# Altium project Gravix Sensor V1 - Rev A.PrjPcb
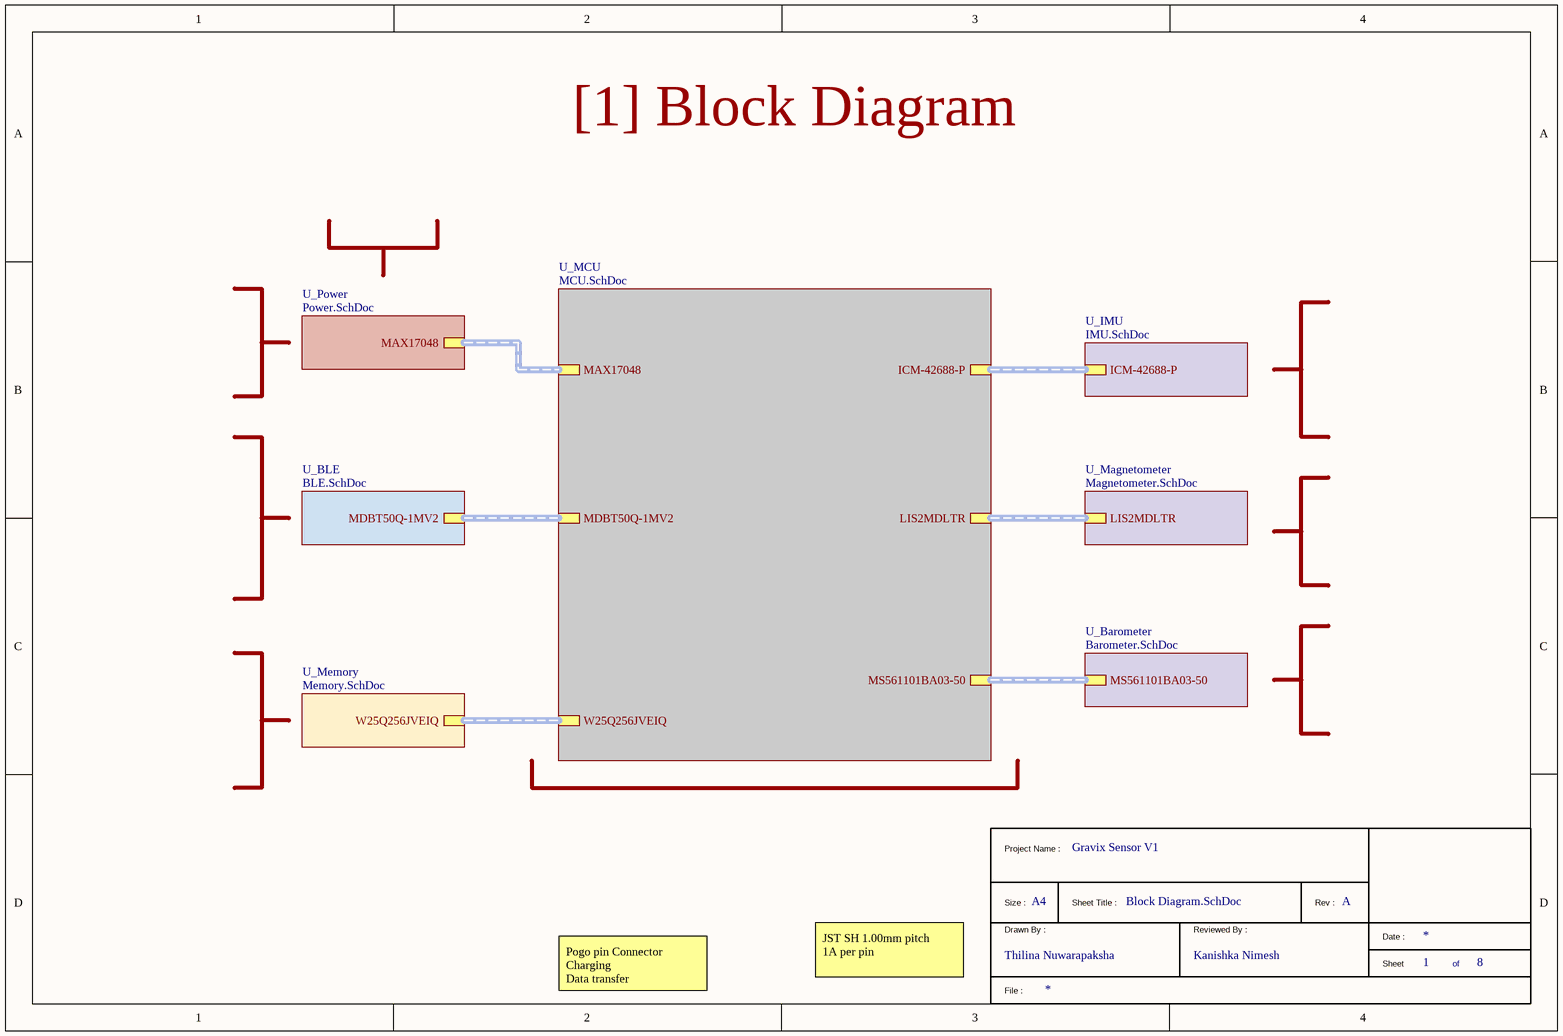
[diagram p0: Block Diagram.SchDoc]
CheckedBy: Kanishka Nimesh; DrawnBy: Thilina Nuwarapaksha; Revision: A; SheetSize: A4; Title: Gravix Sensor V1
8 sheets, 125 parts. Net scope: hierarchical (ports join the sheet entries above them; power ports are global).
Sheets:
  Block Diagram.SchDoc
    U_Power = Power.SchDoc
    U_Barometer = Barometer.SchDoc
    U_BLE = BLE.SchDoc
    U_IMU = IMU.SchDoc
    U_Magnetometer = Magnetometer.SchDoc
    U_MCU = MCU.SchDoc
    U_Memory = Memory.SchDoc

## Sheet Block Diagram.SchDoc: Gravix Sensor V1
size A4; SheetNumber: 1; SheetTotal: 8

### Parts
(Parts that share a designator on the sheet are numbered #1, #2 ... from top to bottom, then left to right.)
*#1  TitleBlock1  (value not drawn)  (graphical)

### Sub-sheets
U_Barometer = Barometer.SchDoc: MS561101BA03-50 (harness Barometer)
U_BLE = BLE.SchDoc: MDBT50Q-1MV2 (harness BLE)
U_IMU = IMU.SchDoc: ICM-42688-P (harness *)
U_Magnetometer = Magnetometer.SchDoc: LIS2MDLTR (harness Magnetometer)
U_MCU = MCU.SchDoc: ICM-42688-P (harness IMU), W25Q256JVEIQ (harness Memory), MAX17048 (harness Fuel gauge), LIS2MDLTR (harness Magnetometer), MS561101BA03-50 (harness Barometer), MDBT50Q-1MV2 (harness BLE)
U_Memory = Memory.SchDoc: W25Q256JVEIQ (harness Memory)
U_Power = Power.SchDoc: MAX17048 (harness Fuel gauge)

### Buses and harness runs
harness sheet U_Barometer/MS561101BA03-50 = sheet U_MCU/MS561101BA03-50
harness sheet U_BLE/MDBT50Q-1MV2 = sheet U_MCU/MDBT50Q-1MV2
harness sheet U_IMU/ICM-42688-P = sheet U_MCU/ICM-42688-P
harness sheet U_Magnetometer/LIS2MDLTR = sheet U_MCU/LIS2MDLTR
harness sheet U_MCU/MAX17048 = sheet U_Power/MAX17048
harness sheet U_MCU/W25Q256JVEIQ = sheet U_Memory/W25Q256JVEIQ

### Notes on the sheet
- [1] Block Diagram
- Pogo pin Connector
  Charging
  Data transfer
- (near *#1) JST SH 1.00mm pitch
  1A per pin
- (in symbol TitleBlock1) Project Name :; Size :; Sheet Title :; Rev :; Drawn By :; Reviewed By :; Date :; Sheet; of; File :

## Sheet Power.SchDoc: Gravix Sensor V1
size A3; SheetNumber: 2; SheetTotal: 8; SheetName: Power
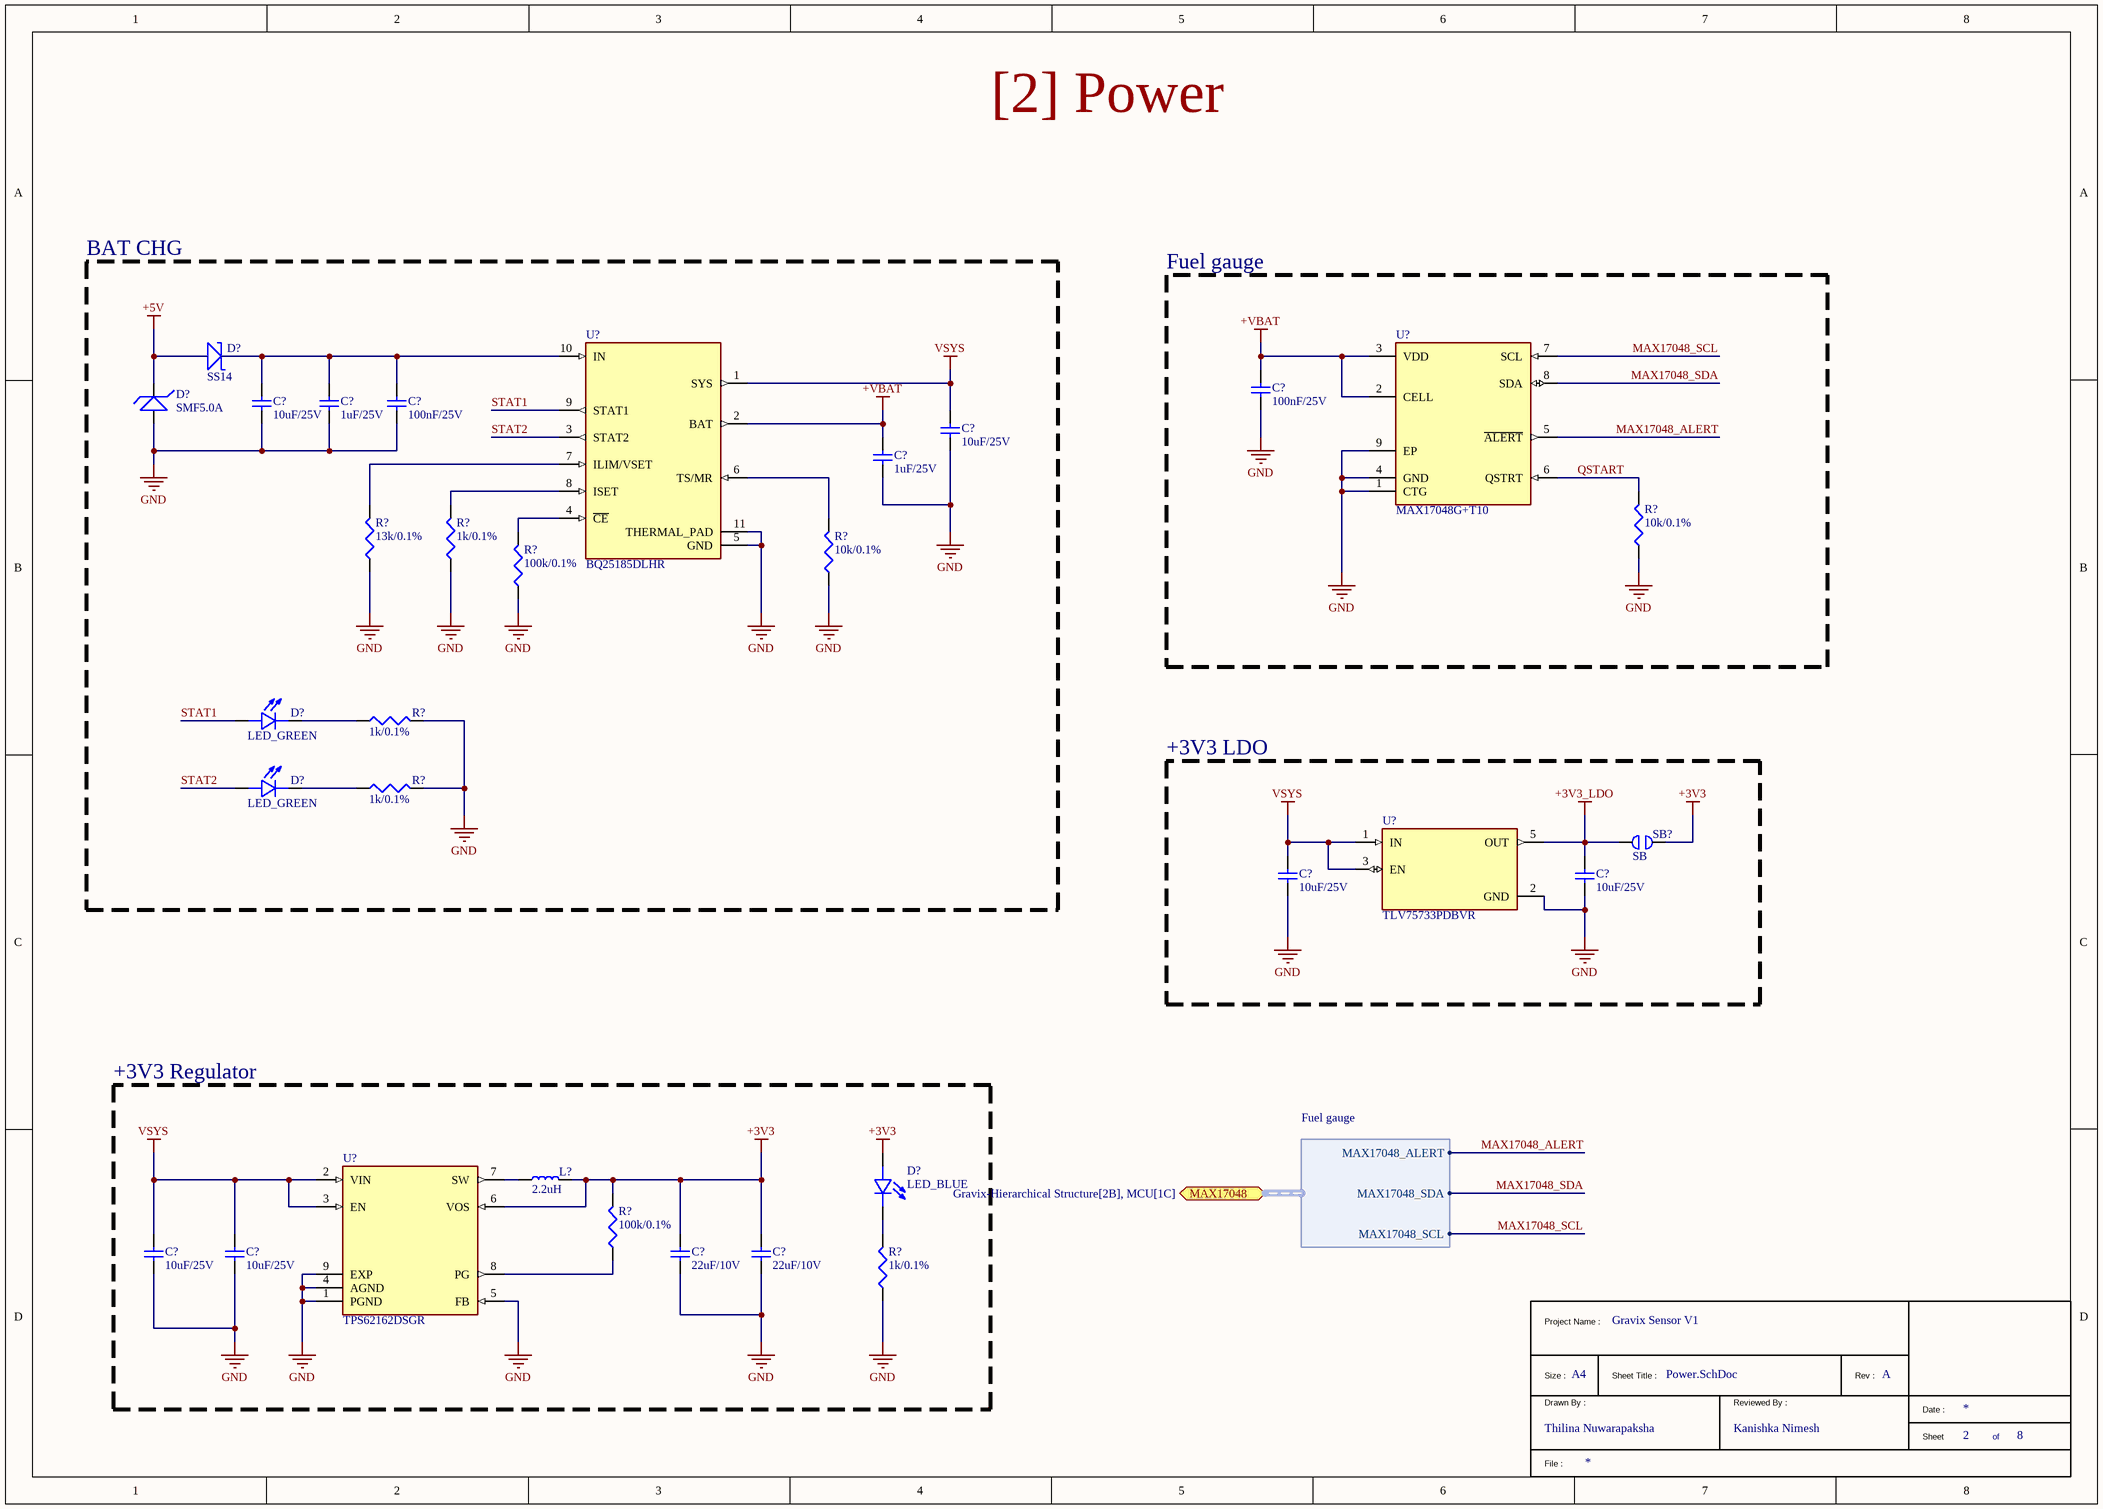
[diagram p1: Power.SchDoc]

### Parts
(Parts that share a designator on the sheet are numbered #1, #2 ... from top to bottom, then left to right.)
*#2  TitleBlock1  (value not drawn)  (graphical)
C?#1  100nF/25V  [CAP_0402]
C?#2  10uF/25V  [CAP_1206]
C?#3  1uF/25V  [CAP_0805]
C?#4  100nF/25V  [CAP_0402]
C?#5  10uF/25V  [CAP_1206]
C?#6  1uF/25V  [CAP_0805]
C?#7  10uF/25V  [CAP_1206]
C?#8  10uF/25V  [CAP_1206]
C?#9  10uF/25V  [CAP_1206]
C?#10  10uF/25V  [CAP_1206]
C?#11  22uF/10V  [CAP_1206]
C?#12  22uF/10V  [CAP_1206]
D?#1  SS14  [SS14_SMA(DO-214AC)]
D?#2  SMF5.0A  [SMF5.0A_]
D?#3  LED_GREEN  [LED_0402]
D?#4  LED_GREEN  [LED_0402]
D?#5  LED_BLUE  [LED_0402]
L?  2.2uH  [IND_SMD,3x3mm]
R?#1  10k/0.1%  [RES_0402]
R?#2  13k/0.1%  [RES_0402]
R?#3  1k/0.1%  [RES_0402]
R?#4  10k/0.1%  [RES_0402]
R?#5  100k/0.1%  [RES_0402]
R?#6  1k/0.1%  [RES_0402]
R?#7  1k/0.1%  [RES_0402]
R?#8  100k/0.1%  [RES_0402]
R?#9  1k/0.1%  [RES_0402]
SB?  SB  [SLD_2P]
U?#1  MAX17048G+T10  [MAX17048G+T10_TDFN-8]
U?#2  BQ25185DLHR  [BQ25185DLHR_WFDFN-10]
U?#3  TLV75733PDBVR  [TLV75733PDBVR_SOT-23-5]
U?#4  TPS62162DSGR  [TPS62162DSGR_WSON-8-EP(2x2)]

### Blocks framed on the sheet
BAT CHG: C?#2-C?#6 D?#1-D?#4 R?#2-R?#7 U?#2
Fuel gauge: C?#1 R?#1 U?#1
+3V3 LDO: C?#7 C?#8 SB? U?#3
+3V3 Regulator: C?#9-C?#12 D?#5 L? R?#8 R?#9 U?#4

### Ports
MAX17048 (bidir, harness Fuel gauge, see Gravix-Hierarchical Structure[2B], MCU[1C])

### Harnesses
Fuel gauge: MAX17048_SCL, MAX17048_SDA, MAX17048_ALERT

### Nets
+3V3: C?#11.2 C?#12.2 D?#5.A L?.2 R?#8.2 SB?.2 U?#4.6(VOS)
+3V3_LDO: C?#8.2 SB?.1 U?#3.5(OUT)
+5V: D?#1.2
+VBAT: C?#1.2 C?#6.2 U?#1.2(CELL) U?#1.3(VDD) U?#2.2(BAT)
GND: C?#1.1 C?#2.1 C?#3.1 C?#4.1 C?#5.1 C?#6.1 C?#7.1 C?#8.1 C?#9.1 C?#10.1 C?#11.1 C?#12.1 R?#1.1 R?#2.1 R?#3.1 R?#4.1 R?#5.1 R?#6.2 R?#7.2 R?#9.1 U?#1.1(CTG) U?#1.4(GND) U?#1.9(EP) U?#2.5(GND) U?#2.11(THERMAL_PAD) U?#3.2(GND) U?#4.1(PGND) U?#4.4(AGND) U?#4.5(FB) U?#4.9(EXP)
VSYS: C?#5.2 C?#7.2 C?#9.2 C?#10.2 U?#2.1(SYS) U?#3.1(IN) U?#3.3(EN) U?#4.2(VIN) U?#4.3(EN)
MAX17048_ALERT: U?#1.5(~{ALERT}) ; port MAX17048.MAX17048_ALERT
MAX17048_SCL: U?#1.7(SCL) ; port MAX17048.MAX17048_SCL
MAX17048_SDA: U?#1.8(SDA) ; port MAX17048.MAX17048_SDA  [project net MAX17048_SCL]
QSTART: R?#1.2 U?#1.6(QSTRT)
STAT1: D?#3.A U?#2.9(STAT1)
STAT2: D?#4.A U?#2.3(STAT2)
NetC?#2_2: C?#2.2 C?#3.2 C?#4.2 D?#1.1 U?#2.10(IN)
NetD?#3_C: D?#3.C R?#6.1
NetD?#4_C: D?#4.C R?#7.1
NetD?#5_C: D?#5.C R?#9.2
NetL?_1: L?.1 U?#4.7(SW)
NetR?#2_2: R?#2.2 U?#2.7(ILIM/VSET)
NetR?#3_2: R?#3.2 U?#2.8(ISET)
NetR?#4_2: R?#4.2 U?#2.6(TS/MR)
NetR?#5_2: R?#5.2 U?#2.4(~{CE})
NetR?#8_1: R?#8.1 U?#4.8(PG)

Not connected (* = marked no-connect by the designer): D?#2 1 2

### Notes on the sheet
- [2] Power
- (in symbol TitleBlock1) Project Name :; Size :; Sheet Title :; Rev :; Drawn By :; Reviewed By :; Date :; Sheet; of; File :

### Library data of the parts
C?#1 C?#4 = YAGEO CC0402JRX7R8BB104: 100nF ±5% 25V Ceramic Capacitor X7R 0402; Manufacturer: YAGEO; Manufacturer Part Number: CC0402JRX7R8BB104; LCSC Part Number: C541465; Package: 0402; Mounting Type: SMD; ComponentLink2Description: Digikey Link; ComponentLink3Description: LCSC Link; ComponentLink3URL: https://www.lcsc.com/product-detail/C541465.html?spm=wm.fly.bg.0.xh___wm.fly.dhl.mly.12-0-4&lcsc_vid=QlAIX1RQQQJfX1VRTwcNAQJXTlRaUQBVEQBYAwJfFFcxVlNRQFhYU1xWRFVdXztW
C?#2 C?#5 C?#7-C?#10 = muRata GRM31CR71E106KA12L: 10uF ±10% 25V Ceramic Capacitor X7R 1206; Manufacturer: muRata; Manufacturer Part Number: GRM31CR71E106KA12L; LCSC Part Number: C77093; Package: 1206; Mounting Type: SMD; ComponentLink2Description: Digikey Link; ComponentLink3Description: LCSC Link; ComponentLink3URL: https://www.lcsc.com/product-detail/C77093.html?spm=wm.fly.bg.1.xh___wm.sxq.dhl.mly.12-0-4&lcsc_vid=QlAIX1RQQQJfX1VRTwcNAQJXTlRaUQBVEQBYAwJfFFcxVlNRT1FaUl1VQVZcUDsOAxUeFF5JWBYZEEoKFBINSQcJGk4%3D
C?#3 C?#6 = YAGEO CC0805KKX7R8BB105: 1uF ±10% 25V Ceramic Capacitor X7R 0805; Manufacturer: YAGEO; Manufacturer Part Number: CC0805KKX7R8BB105; LCSC Part Number: C91186; Package: 0805; Mounting Type: SMD; ComponentLink2Description: Digikey Link; ComponentLink3Description: LCSC Link; ComponentLink3URL: https://www.lcsc.com/product-detail/C91186.html?spm=wm.fly.bg.0.xh___wm.fly.dhl.mly.12-0-4&lcsc_vid=QlAIX1RQQQJfX1VRTwcNAQJXTlRaUQBVEQBYAwJfFFcxVlNRT1FbV1FfR1JZUDsOAxUeFF5JWBYZEEoKFBINSQcJGk4dAgUUFAk%3D
C?#11 C?#12 = muRata GRM31CR71A226KE15L: 22uF ±10% 10V Ceramic Capacitor X7R 1206; Manufacturer: muRata; Manufacturer Part Number: GRM31CR71A226KE15L; LCSC Part Number: C91604; Package: 1206; Mounting Type: SMD; ComponentLink2Description: Digikey Link; ComponentLink3Description: LCSC Link; ComponentLink3URL: https://www.lcsc.com/product-detail/C91604.html?s_z=n_q_C91604
D?#1 = onsemi SS14: Diode 40V 1A Surface Mount SMA(DO-214AC); Manufacturer: onsemi; Manufacturer Part Number: SS14; LCSC Part Number: C83852; Package: SMA(DO-214AC); Mounting Type: SMD; ComponentLink2Description: Digikey Link; ComponentLink3Description: LCSC Link; ComponentLink3URL: https://www.lcsc.com/product-detail/C83852.html?s_z=n_q_x_SS14&spm=wm.ssy.em.2.tz&lcsc_vid=TgRYXlMEFQVcUQVUT1hcVlJUQ1MPAlRVQVBcVABeFAUxVlNRT1RZVFVUQVBXUTsOAxUeFF5JWBYZEEoKFBINSQcJGk4eFQsCAgIaSgADAwAHC0slRVVWV0oOAwwC
D?#2 = Littelfuse SMF5.0A: 9.2VC Clamp 21.7A Ipp TVS DIODE SOD-123FL; Manufacturer: Littelfuse; Manufacturer Part Number: SMF5.0A; LCSC Part Number: C151296; Package: SOD-123FL; Mounting Type: SMD; ComponentLink2Description: Digikey Link; ComponentLink3Description: LCSC Link; ComponentLink3URL: https://www.lcsc.com/product-detail/C151296.html?s_z=n_q_SMF5.0A&spm=wm.fly.bg.0.xh&lcsc_vid=TgRYXlMEFQVcUQVUT1hcVlJUQ1MPAlRVQVBcVABeFAUxVlNRT1RZVFRUQ1NdUTsOAxUeFF5JWBYZEEoKFBINSQcJGk4eFQsCAgIaSgADAwAHC0slQFRfXkoOAwwC
D?#3 D?#4 = LED_GREEN: Green 520nm LED Indication - Discrete 2.8V 0402; Manufacturer: BrtLed; Manufacturer Part Number: BL-HGK37A-AV-TRB; LCSC Part Number: C5123485; Package: 0402; ComponentLink1Description: Digikey Link; ComponentLink2Description: LCSC Link; ComponentLink2URL: https://www.lcsc.com/product-detail/C5123485.html?s_z=n_q_t_led&spm=wm.fly.bg.0.xh___wm.ssy.tc.0.tz&lcsc_vid=QlAIX1RQQQJfX1VRTwcNAQJXTlRaUQBVEQBYAwJfFFcxVlNRT1RWVlJfRFhYUjsOAxUeFF5JWBYZEEoKFBINSQcJGk4eFQsCAgIaSgADAwAHC0slRlZXU1VSWQkaCgg%3D; Mounting Type: SMD
D?#5 = LED_BLUE: Blue 468nm LED Indication - Discrete 2.8V 0402; Manufacturer: VISHAY; Manufacturer Part Number: VLMB1500-GS08; LCSC Part Number: C511042; Package: 0402; ComponentLink1Description: Digikey Link; ComponentLink2Description: LCSC Link; ComponentLink2URL: https://www.lcsc.com/product-detail/C511042.html?s_z=n_q_t_led&spm=wm.fly.bg.0.xh___wm.ssy.tc.0.tz&lcsc_vid=QlAIX1RQQQJfX1VRTwcNAQJXTlRaUQBVEQBYAwJfFFcxVlNRT1RWVlJfRFhYUjsOAxUeFF5JWBYZEEoKFBINSQcJGk4eFQsCAgIaSgADAwAHC0slRlZXU1VSWQkaCgg%3D; Mounting Type: SMD
L? = Coilcraft XFL3012-222MEC: 1.9A 2.2uH ±20% 97mΩ 1.6A Magnetic Shielded Inductor SMD,3x3mm Fixed Inductors RoHS; Manufacturer: Coilcraft; Manufacturer Part Number: XFL3012-222MEC; LCSC Part Number: C3911432; Package: SMD,3x3mm; ComponentLink1Description: Digikey Link; Mounting Type: SMD; ComponentLink2Description: LCSC Link; ComponentLink2URL: https://www.lcsc.com/product-detail/C3911432.html?s_z=n_q_XFL3012-222MEC&spm=wm.ssy.bg.0.xh&lcsc_vid=QlAIX1RQQQJfX1VRTwcNAQJXTlRaUQBVEQBYAwJfFFcxVlNRT1FaUl1VQVZcUDsOAxUeFF5JWBYZEEoKFBINSQcJGk4%3D
R?#1 R?#4 = YAGEO RT0402BRD0710KL: 62.5mW 10kΩ 50V Thin Film Resistor ±25ppm/℃ ±0.1% 0402 Chip Resistor - Surface Mount RoHS; Manufacturer: YAGEO; Manufacturer Part Number: RT0402BRD0710KL; LCSC Part Number: C190095; Package: 0402; ComponentLink1Description: Digikey Link; Mounting Type: SMD; ComponentLink2Description: LCSC Link; ComponentLink2URL: https://www.lcsc.com/product-detail/C190095.html?spm=wm.fly.bg.0.xh___wm.fly.dhl.mly.12-6-1&lcsc_vid=QlAIX1RQQQJfX1VRTwcNAQJXTlRaUQBVEQBYAwJfFFcxVlNRT1FbV1FfR1JZUDsOAxUeFF5JWBYZEEoKFBINSQcJGk4dAgUUFAk%3D
R?#2 = YAGEO RT0402BRD0713KL: 62.5mW 13kΩ 50V Thin Film Resistor ±25ppm/℃ ±0.1% 0402 Chip Resistor - Surface Mount RoHS; Manufacturer: YAGEO; Manufacturer Part Number: RT0402BRD0713KL; LCSC Part Number: C852524; Package: 0402; ComponentLink1Description: Digikey Link; Mounting Type: SMD; ComponentLink2Description: LCSC Link; ComponentLink2URL: https://www.lcsc.com/product-detail/C852524.html?spm=wm.fly.bg.0.xh___wm.sxq.dhl.mly.12-6-1&lcsc_vid=QlAIX1RQQQJfX1VRTwcNAQJXTlRaUQBVEQBYAwJfFFcxVlNRT1FbV1FfR1JZUDsOAxUeFF5JWBYZEEoKFBINSQcJGk4dAgUUFAk%3D
R?#3 R?#6 R?#7 R?#9 = YAGEO RT0402BRD071KL: 1kΩ 62.5mW 50V Thin Film Resistor ±25ppm/℃ ±0.1% 0402 Chip Resistor - Surface Mount RoHS; Manufacturer: YAGEO; Manufacturer Part Number: RT0402BRD071KL; LCSC Part Number: C852624; Package: 0402; ComponentLink1Description: Digikey Link; Mounting Type: SMD; ComponentLink2Description: LCSC Link; ComponentLink2URL: https://www.lcsc.com/product-detail/C852624.html?spm=wm.fly.bg.0.xh___wm.sxq.dhl.mly.12-6-1&lcsc_vid=QlAIX1RQQQJfX1VRTwcNAQJXTlRaUQBVEQBYAwJfFFcxVlNRT1FbV1FfR1JZUDsOAxUeFF5JWBYZEEoKFBINSQcJGk4dAgUUFAk%3D
R?#5 R?#8 = YAGEO RT0402BRD07100KL: 100kΩ 62.5mW 50V Thin Film Resistor ±25ppm/℃ ±0.1% 0402 Chip Resistor - Surface Mount RoHS; Manufacturer: YAGEO; Manufacturer Part Number: RT0402BRD07100KL; LCSC Part Number: C852472; Package: 0402; ComponentLink1Description: Digikey Link; Mounting Type: SMD; ComponentLink2Description: LCSC Link; ComponentLink2URL: https://www.lcsc.com/product-detail/C852472.html?spm=wm.fly.bg.0.xh___wm.fly.dhl.mly.12-6-1&lcsc_vid=QlAIX1RQQQJfX1VRTwcNAQJXTlRaUQBVEQBYAwJfFFcxVlNRT1FbV1FfR1JZUDsOAxUeFF5JWBYZEEoKFBINSQcJGk4dAgUUFAk%3D
SB? = SLD_2P
U?#1 = MAXIM MAX17048G+T10: Lithium Battery I2C DFN-8-EP(2x2) Battery Management RoHS; Manufacturer: MAXIM; Manufacturer Part Number: MAX17048G+T10; LCSC Part Number: C2682616; Package: DFN-8-EP(2x2); Mounting Type: SMD; ComponentLink2Description: Digikey Link; ComponentLink3Description: LCSC Link; ComponentLink3URL: https://www.lcsc.com/product-detail/C2682616.html?s_z=n_q_C2682616
U?#2 = TI BQ25185DLHR: 1-Cell, 1-A Standalone Linear Battery Charger with PowerPath, Factory Mode, and Battery Tracking VINDPM; Manufacturer: TI; Manufacturer Part Number: BQ25185DLHR; LCSC Part Number: C19725033; Package: WSON-10-EP(2.2x2); Mounting Type: SMD; ComponentLink2Description: Digikey Link; ComponentLink3Description: LCSC Link; ComponentLink3URL: https://www.lcsc.com/product-detail/C19725033.html?s_z=n_q_C19725033
U?#3 = TI TLV75733PDBVR: 3.3V Positive Fixed SOT-23-5 Voltage Regulators - Linear, Low Drop Out (LDO) Regulators RoHS; Manufacturer: TI; Manufacturer Part Number: TLV75733PDBVR; LCSC Part Number: C485517; Package: SOT-23-5; Mounting Type: SMD; ComponentLink2Description: Digikey Link; ComponentLink3Description: LCSC Link; ComponentLink3URL: https://www.lcsc.com/product-detail/C485517.html?spm=wm.fly.bg.0.xh&lcsc_vid=QlAIX1RQQQJfX1VRTwcNAQJXTlRaUQBVEQBYAwJfFFcxVlNRT1FbV1FfR1JZUDsOAxUeFF5JWBYZEEoKFBINSQcJGk4dAgUUFAk%3D
U?#4 = TI TPS62162DSGR: 2.25MHz Step-down type Fixed 3.3V 1A WSON-8-EP(2x2) Voltage Regulators - DC DC Switching Regulators RoHS; Manufacturer: TI; Manufacturer Part Number: TPS62162DSGR; LCSC Part Number: C40256; Package: WSON-8-EP(2x2); Mounting Type: SMD; ComponentLink2Description: Digikey Link; ComponentLink3Description: LCSC Link; ComponentLink3URL: https://www.lcsc.com/product-detail/C40256.html?s_z=n_q_TPS62162&spm=wm.ssy.bg.0.xh&lcsc_vid=QlAIX1RQQQJfX1VRTwcNAQJXTlRaUQBVEQBYAwJfFFcxVlNRQFhXUFJST1hcUTsOAxUeFF5JWBYZEEoKFBINSQcJGk4%3D

## Sheet Barometer.SchDoc: Gravix Sensor V1
size A4; SheetNumber: 6; SheetTotal: 8
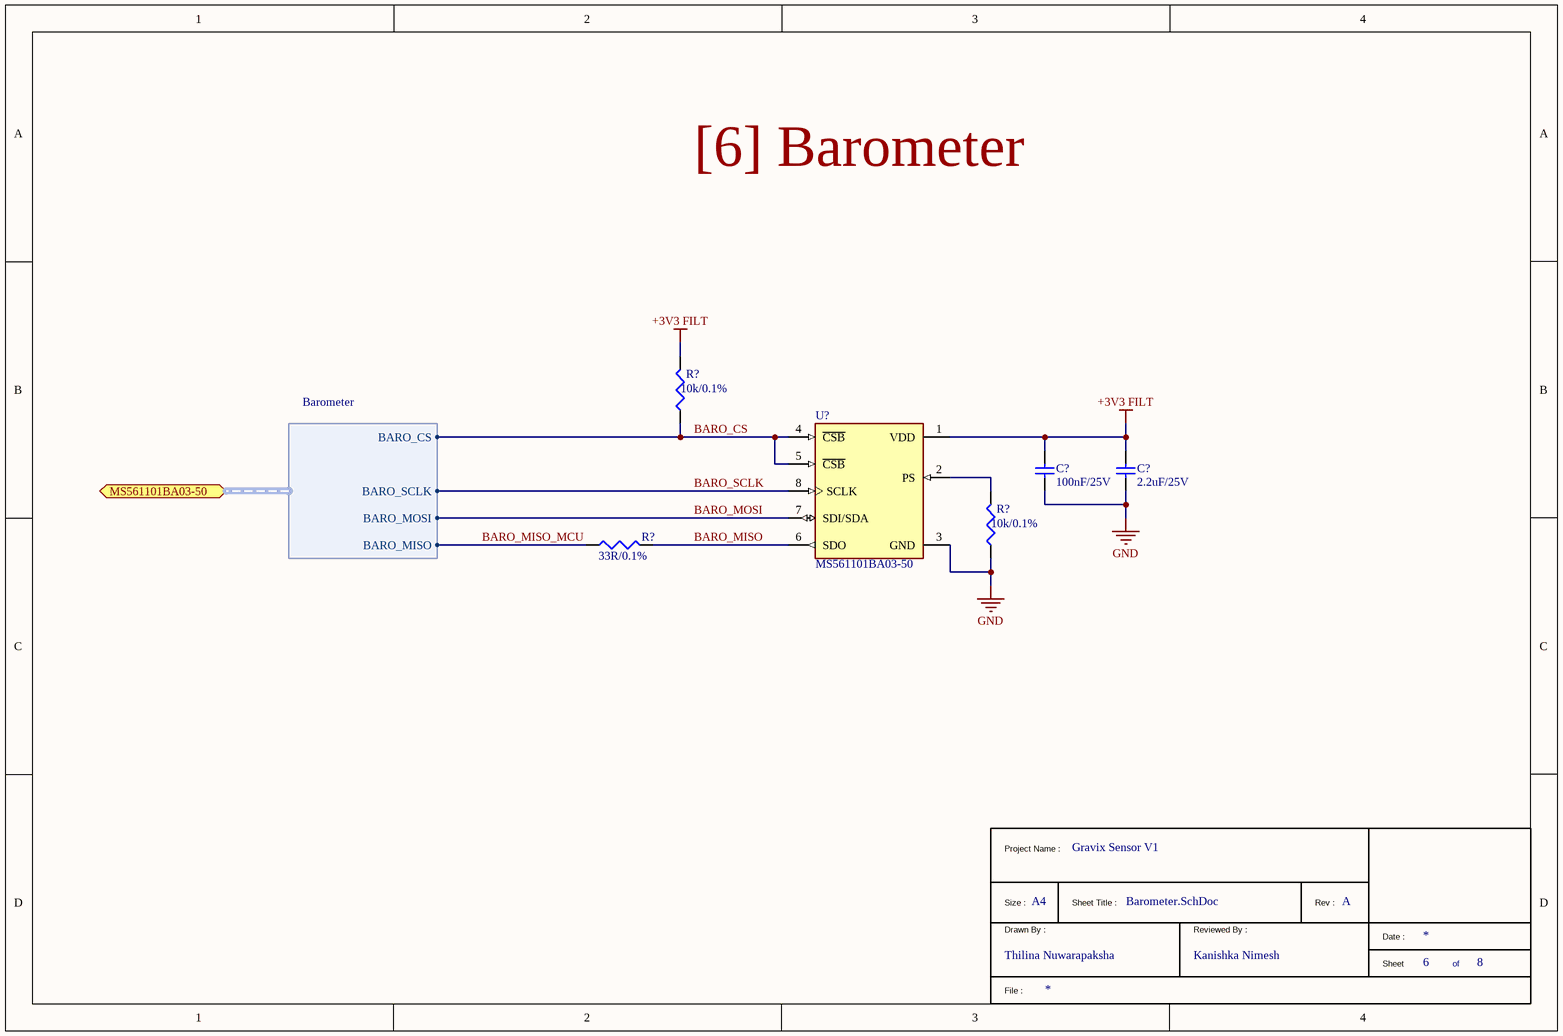
[diagram p2: Barometer.SchDoc]

### Parts
(Parts that share a designator on the sheet are numbered #1, #2 ... from top to bottom, then left to right.)
*#3  TitleBlock1  (value not drawn)  (graphical)
C?#13  100nF/25V  [CAP_0402]
C?#14  2.2uF/25V  [CAP_0805]
R?#10  10k/0.1%  [RES_0402]
R?#11  10k/0.1%  [RES_0402]
R?#12  33R/0.1%  [RES_0402]
U?#5  MS561101BA03-50  [MS561101BA03-50_QFN-8(3x5)]

### Ports
MS561101BA03-50 (bidir, harness Barometer)

### Harnesses
Barometer: BARO_CS, BARO_SCLK, BARO_MOSI, BARO_MISO

### Nets
+3V3 FILT: C?#13.2 C?#14.2 R?#10.2 U?#5.1(VDD)
GND: C?#13.1 C?#14.1 R?#11.1 U?#5.3(GND)
BARO_CS: R?#10.1 U?#5.4(~{CSB}) U?#5.5(~{CSB}) ; port MS561101BA03-50.BARO_CS
BARO_MISO: R?#12.2 U?#5.6(SDO)
BARO_MISO_MCU: R?#12.1 ; port MS561101BA03-50.BARO_MISO
BARO_MOSI: U?#5.7(SDI/SDA) ; port MS561101BA03-50.BARO_MOSI
BARO_SCLK: U?#5.8(SCLK) ; port MS561101BA03-50.BARO_SCLK
NetR?#11_2: R?#11.2 U?#5.2(PS)

### Notes on the sheet
- [6] Barometer
- (in symbol TitleBlock1) Project Name :; Size :; Sheet Title :; Rev :; Drawn By :; Reviewed By :; Date :; Sheet; of; File :

### Library data of the parts
C?#13 = YAGEO CC0402JRX7R8BB104: as C?#1 on sheet Power; Manufacturer Part Number: CC0402JRX7R8BB104; LCSC Part Number: C541465; Package: 0402; Mounting Type: SMD; ComponentLink2Description: Digikey Link; ComponentLink3Description: LCSC Link; ComponentLink3URL: https://www.lcsc.com/product-detail/C541465.html?spm=wm.fly.bg.0.xh___wm.fly.dhl.mly.12-0-4&lcsc_vid=QlAIX1RQQQJfX1VRTwcNAQJXTlRaUQBVEQBYAwJfFFcxVlNRQFhYU1xWRFVdXztW
C?#14 = YAGEO CC0805KKX7R8BB225: 2.2uF ±10% 25V Ceramic Capacitor X7R 0805; Manufacturer: YAGEO; Manufacturer Part Number: CC0805KKX7R8BB225; LCSC Part Number: C277470; Package: 0805; Mounting Type: SMD; ComponentLink2Description: Digikey Link; ComponentLink3Description: LCSC Link; ComponentLink3URL: https://www.lcsc.com/product-detail/C277470.html?spm=wm.fly.bg.0.xh___wm.sy.dhl.mly.12-0-4&lcsc_vid=QlAIX1RQQQJfX1VRTwcNAQJXTlRaUQBVEQBYAwJfFFcxVlNRT1BcUFBQTlRYVTtW
R?#10 R?#11 = YAGEO RT0402BRD0710KL: as R?#1 on sheet Power; Manufacturer Part Number: RT0402BRD0710KL; LCSC Part Number: C190095; Package: 0402; ComponentLink1Description: Digikey Link; Mounting Type: SMD; ComponentLink2Description: LCSC Link; ComponentLink2URL: https://www.lcsc.com/product-detail/C190095.html?spm=wm.fly.bg.0.xh___wm.fly.dhl.mly.12-6-1&lcsc_vid=QlAIX1RQQQJfX1VRTwcNAQJXTlRaUQBVEQBYAwJfFFcxVlNRT1FbV1FfR1JZUDsOAxUeFF5JWBYZEEoKFBINSQcJGk4dAgUUFAk%3D
R?#12 = YAGEO RT0402BRD0733RL: 33Ω 63mW 50V Thin Film Resistor ±25ppm/℃ ±0.1% 0402 Chip Resistor - Surface Mount RoHS; Manufacturer: YAGEO; Manufacturer Part Number: RT0402BRD0733RL; LCSC Part Number: C852729; Package: 0402; ComponentLink1Description: Digikey Link; Mounting Type: SMD; ComponentLink2Description: LCSC Link; ComponentLink2URL: https://www.lcsc.com/product-detail/C852729.html?spm=wm.fly.bg.0.xh___wm.fly.dhl.mly.12-6-1&lcsc_vid=QlAIX1RQQQJfX1VRTwcNAQJXTlRaUQBVEQBYAwJfFFcxVlNRT1BXUFVTRlNXVDtW
U?#5 = TE Connectivity MS561101BA03-50: 1Kpa~1.2bar QFN-8(3x5) Pressure Sensors, Transducers RoHS; Manufacturer: TE Connectivity; Manufacturer Part Number: MS561101BA03-50; LCSC Part Number: C15639; Package: QFN-8(3x5); Mounting Type: SMD; ComponentLink2Description: Digikey Link; ComponentLink3Description: LCSC Link; ComponentLink3URL: https://www.lcsc.com/product-detail/C15639.html?s_z=n_q_C15639

## Sheet BLE.SchDoc: Gravix Sensor V1
size A4; CheckedBy: Kanishka Nimesh; DrawnBy: Thilina Nuwarapaksha; Revision: A; SheetNumber: 4; SheetTotal: 8
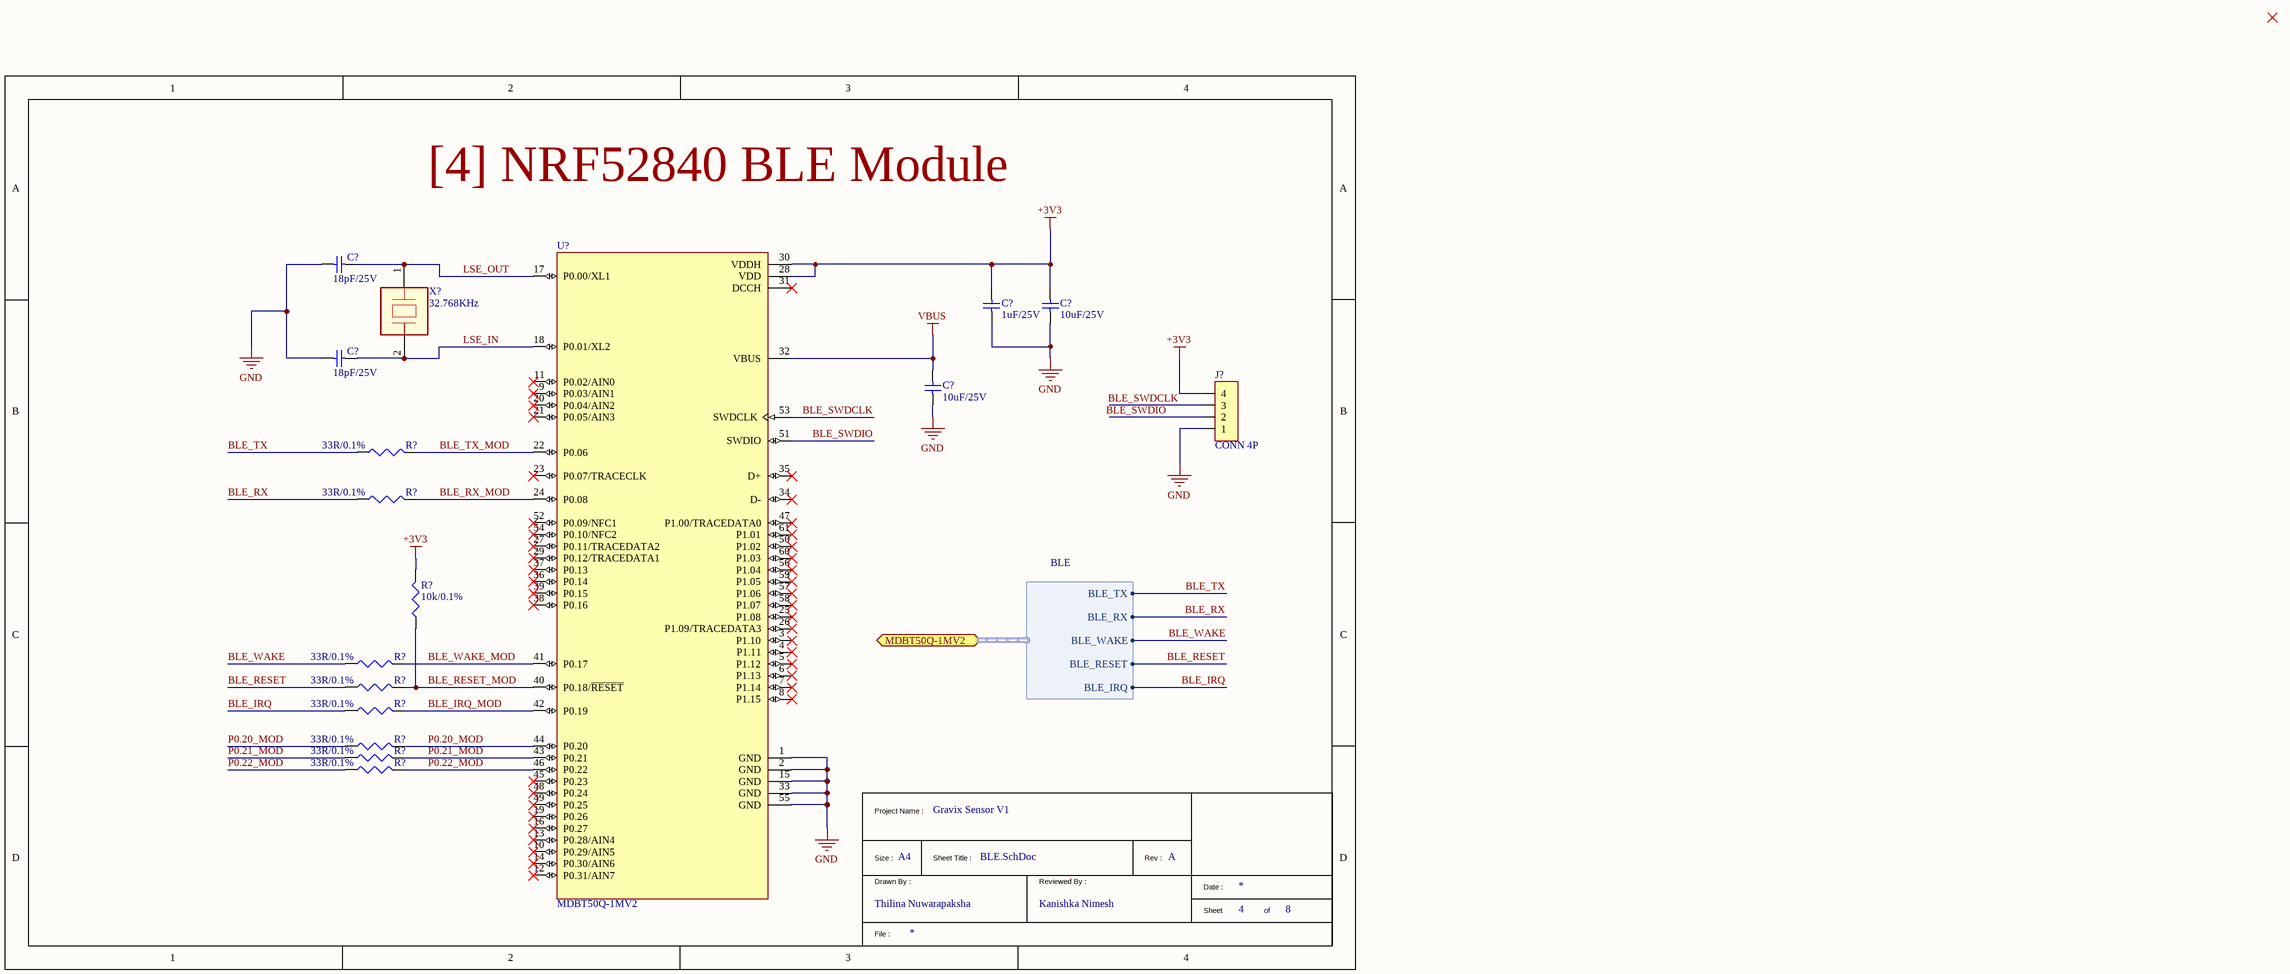
[diagram p3: BLE.SchDoc]

### Parts
(Parts that share a designator on the sheet are numbered #1, #2 ... from top to bottom, then left to right.)
*#4  TitleBlock1  (value not drawn)  (graphical)
C?#15  18pF/25V  [CAP_0402]
C?#16  1uF/25V  [CAP_0805]
C?#17  10uF/25V  [CAP_1206]
C?#18  18pF/25V  [CAP_0402]
C?#19  10uF/25V  [CAP_1206]
J?#1  CONN 4P  [JST_SH_1.00]
R?#13  33R/0.1%  [RES_0402]
R?#14  33R/0.1%  [RES_0402]
R?#15  10k/0.1%  [RES_0402]
R?#16  33R/0.1%  [RES_0402]
R?#17  33R/0.1%  [RES_0402]
R?#18  33R/0.1%  [RES_0402]
R?#19  33R/0.1%  [RES_0402]
R?#20  33R/0.1%  [RES_0402]
R?#21  33R/0.1%  [RES_0402]
U?#6  MDBT50Q-1MV2  [MDBT50Q-1MV2_SMD-61]
X?#1  32.768KHz  [32.768KHz_SMD2012-2P]

### Ports
MDBT50Q-1MV2 (bidir, harness BLE)

### Harnesses
BLE: BLE_TX, BLE_RX, BLE_WAKE, BLE_RESET, BLE_IRQ

### Nets
+3V3: C?#16.2 C?#17.2 J?#1.4 R?#15.2 U?#6.28(VDD) U?#6.30(VDDH)
GND: C?#15.2 C?#16.1 C?#17.1 C?#18.2 C?#19.1 J?#1.1 U?#6.1(GND) U?#6.2(GND) U?#6.15(GND) U?#6.33(GND) U?#6.55(GND)
VBUS: C?#19.2 U?#6.32(VBUS)
BLE_IRQ: R?#18.1 ; port MDBT50Q-1MV2.BLE_IRQ
BLE_IRQ_MOD: R?#18.2 U?#6.42(P0.19)
BLE_RESET: R?#17.1 ; port MDBT50Q-1MV2.BLE_RESET
BLE_RESET_MOD: R?#15.1 R?#17.2 U?#6.40(P0.18/~{RESET})
BLE_RX: R?#14.1 ; port MDBT50Q-1MV2.BLE_RX
BLE_RX_MOD: R?#14.2 U?#6.24(P0.08)
BLE_SWDCLK: J?#1.3 U?#6.53(SWDCLK)
BLE_SWDIO: J?#1.2 U?#6.51(SWDIO)
BLE_TX: R?#13.1 ; port MDBT50Q-1MV2.BLE_TX
BLE_TX_MOD: R?#13.2 U?#6.22(P0.06)
BLE_WAKE: R?#16.1 ; port MDBT50Q-1MV2.BLE_WAKE
BLE_WAKE_MOD: R?#16.2 U?#6.41(P0.17)
LSE_IN: C?#18.1 U?#6.18(P0.01/XL2) X?#1.2(GND)
LSE_OUT: C?#15.1 U?#6.17(P0.00/XL1) X?#1.1
P0.20_MOD: R?#19.1 R?#19.2 U?#6.44(P0.20)
P0.21_MOD: R?#20.1 R?#20.2 U?#6.43(P0.21)
P0.22_MOD: R?#21.1 R?#21.2 U?#6.46(P0.22)

Not connected (* = marked no-connect by the designer): U?#6 3(P1.10)* 4(P1.11)* 5(P1.12)* 6(P1.13)* 7(P1.14)* 8(P1.15)* 9(P0.03/AIN1)* 10(P0.29/AIN5)* 11(P0.02/AIN0)* 12(P0.31/AIN7)* 13(P0.28/AIN4)* 14(P0.30/AIN6)* 16(P0.27)* 19(P0.26)* 20(P0.04/AIN2)* 21(P0.05/AIN3)* 23(P0.07/TRACECLK)* 25(P1.08)* 26(P1.09/TRACEDATA3)* 27(P0.11/TRACEDATA2)* 29(P0.12/TRACEDATA1)* 31(DCCH)* 34(D-)* 35(D+)* 36(P0.14)* 37(P0.13)* 38(P0.16)* 39(P0.15)* 45(P0.23)* 47(P1.00/TRACEDATA0)* 48(P0.24)* 49(P0.25)* 50(P1.02)* 52(P0.09/NFC1)* 54(P0.10/NFC2)* 56(P1.04)* 57(P1.06)* 58(P1.07)* 59(P1.05)* 60(P1.03)* 61(P1.01)*

### Notes on the sheet
- [4] NRF52840 BLE Module
- (in symbol TitleBlock1) Project Name :; Size :; Sheet Title :; Rev :; Drawn By :; Reviewed By :; Date :; Sheet; of; File :

### Library data of the parts
C?#15 C?#18 = YAGEO CC0402GRNPO8BN180: 18pF ±2% 25V Ceramic Capacitor NP0 0402; Manufacturer: YAGEO; Manufacturer Part Number: CC0402GRNPO8BN180; LCSC Part Number: C526984; Package: 0402; Mounting Type: SMD; ComponentLink2Description: Digikey Link; ComponentLink3Description: LCSC Link; ComponentLink3URL: https://www.lcsc.com/product-detail/C526984.html?spm=wm.fly.bg.0.xh___wm.fly.dhl.mly.12-0-4&lcsc_vid=QlAIX1RQQQJfX1VRTwcNAQJXTlRaUQBVEQBYAwJfFFcxVlNRQFhYU1xWRFVdXztW
C?#16 = YAGEO CC0805KKX7R8BB105: as C?#3 on sheet Power; Manufacturer Part Number: CC0805KKX7R8BB105; LCSC Part Number: C91186; Package: 0805; Mounting Type: SMD; ComponentLink2Description: Digikey Link; ComponentLink3Description: LCSC Link; ComponentLink3URL: https://www.lcsc.com/product-detail/C91186.html?spm=wm.fly.bg.0.xh___wm.fly.dhl.mly.12-0-4&lcsc_vid=QlAIX1RQQQJfX1VRTwcNAQJXTlRaUQBVEQBYAwJfFFcxVlNRT1FbV1FfR1JZUDsOAxUeFF5JWBYZEEoKFBINSQcJGk4dAgUUFAk%3D
C?#17 C?#19 = muRata GRM31CR71E106KA12L: as C?#2 on sheet Power; Manufacturer Part Number: GRM31CR71E106KA12L; LCSC Part Number: C77093; Package: 1206; Mounting Type: SMD; ComponentLink2Description: Digikey Link; ComponentLink3Description: LCSC Link; ComponentLink3URL: https://www.lcsc.com/product-detail/C77093.html?spm=wm.fly.bg.1.xh___wm.sxq.dhl.mly.12-0-4&lcsc_vid=QlAIX1RQQQJfX1VRTwcNAQJXTlRaUQBVEQBYAwJfFFcxVlNRT1FaUl1VQVZcUDsOAxUeFF5JWBYZEEoKFBINSQcJGk4%3D
J?#1 = JST_4P_SH: Connector Header 4 position 1mm Pitch 1A Surface Mount, Right Angle -25℃~+85℃; Manufacturer: JST; Manufacturer Part Number: SM04B-SRSS-TB(LF)(SN); LCSC Part Number: C160404; Package: SMD,P=1mm,Surface Mount,Right Angle; ComponentLink1Description: Digikey Link; Mounting Type: SMD; ComponentLink2Description: LCSC Link; ComponentLink2URL: https://www.lcsc.com/product-detail/C160404.html?spm=wm.fly.bg.0.xh&lcsc_vid=QlAIX1RQQQJfX1VRTwcNAQJXTlRaUQBVEQBYAwJfFFcxVlNRT1RYUldfQ1BaVTsOAxUeFF5JWBYZEEoKFBINSQcJGk4NBhADEA4cHktRTlNADxALGw%3D%3D
R?#13 R?#14 R?#16-R?#21 = YAGEO RT0402BRD0733RL: as R?#12 on sheet Barometer; Manufacturer Part Number: RT0402BRD0733RL; LCSC Part Number: C852729; Package: 0402; ComponentLink1Description: Digikey Link; Mounting Type: SMD; ComponentLink2Description: LCSC Link; ComponentLink2URL: https://www.lcsc.com/product-detail/C852729.html?spm=wm.fly.bg.0.xh___wm.fly.dhl.mly.12-6-1&lcsc_vid=QlAIX1RQQQJfX1VRTwcNAQJXTlRaUQBVEQBYAwJfFFcxVlNRT1BXUFVTRlNXVDtW
R?#15 = YAGEO RT0402BRD0710KL: as R?#1 on sheet Power; Manufacturer Part Number: RT0402BRD0710KL; LCSC Part Number: C190095; Package: 0402; ComponentLink1Description: Digikey Link; Mounting Type: SMD; ComponentLink2Description: LCSC Link; ComponentLink2URL: https://www.lcsc.com/product-detail/C190095.html?spm=wm.fly.bg.0.xh___wm.fly.dhl.mly.12-6-1&lcsc_vid=QlAIX1RQQQJfX1VRTwcNAQJXTlRaUQBVEQBYAwJfFFcxVlNRT1FbV1FfR1JZUDsOAxUeFF5JWBYZEEoKFBINSQcJGk4dAgUUFAk%3D
U?#6 = RAYTAC MDBT50Q-1MV2: SMD-61P RF Transceiver Modules and Modems RoHS; Manufacturer: RAYTAC; Manufacturer Part Number: MDBT50Q-1MV2; LCSC Part Number: C5118826; Package: SMD-61P; Mounting Type: SMD; ComponentLink2Description: Digikey Link; ComponentLink3Description: LCSC Link; ComponentLink3URL: https://www.lcsc.com/product-detail/C5118826.html?s_z=n_q_MDBT50Q-1MV2&spm=wm.ssy.bg.0.xh&lcsc_vid=QlAIX1RQQQJfX1VRTwcNAQJXTlRaUQBVEQBYAwJfFFcxVlNRQFhZUlxfQlRcXzsOAxUeFF5JWBYZEEoKFBINSQcJGk4eFQsCAgIaSgADAwAHC0slRlRZU1ZIHxUDCw%3D%3D
X?#1 = 32.768KHz 2P: Crystal 32.768kHz ±20ppm 12.5pF SMD2012-2P; Manufacturer: KYX; Manufacturer Part Number: K2A32768125202; LCSC Part Number: C19076730; Package: SMD2012-2P; ComponentLink1Description: Digikey Link; ComponentLink2Description: LCSC Link; ComponentLink2URL: https://www.lcsc.com/product-detail/C19076730.html?spm=wm.fly.bg.2.xh___wm.sxq.dhl.mly.12-1-1&lcsc_vid=QlAIX1RQQQJfX1VRTwcNAQJXTlRaUQBVEQBYAwJfFFcxVlNRQFhYU1xWRFVdXztW; Mounting Type: SMD

## Sheet IMU.SchDoc: Gravix Sensor V1
size A4; CheckedBy: Kanishka Nimesh; DrawnBy: Thilina Nuwarapaksha; Revision: A; SheetNumber: 5; SheetTotal: 8
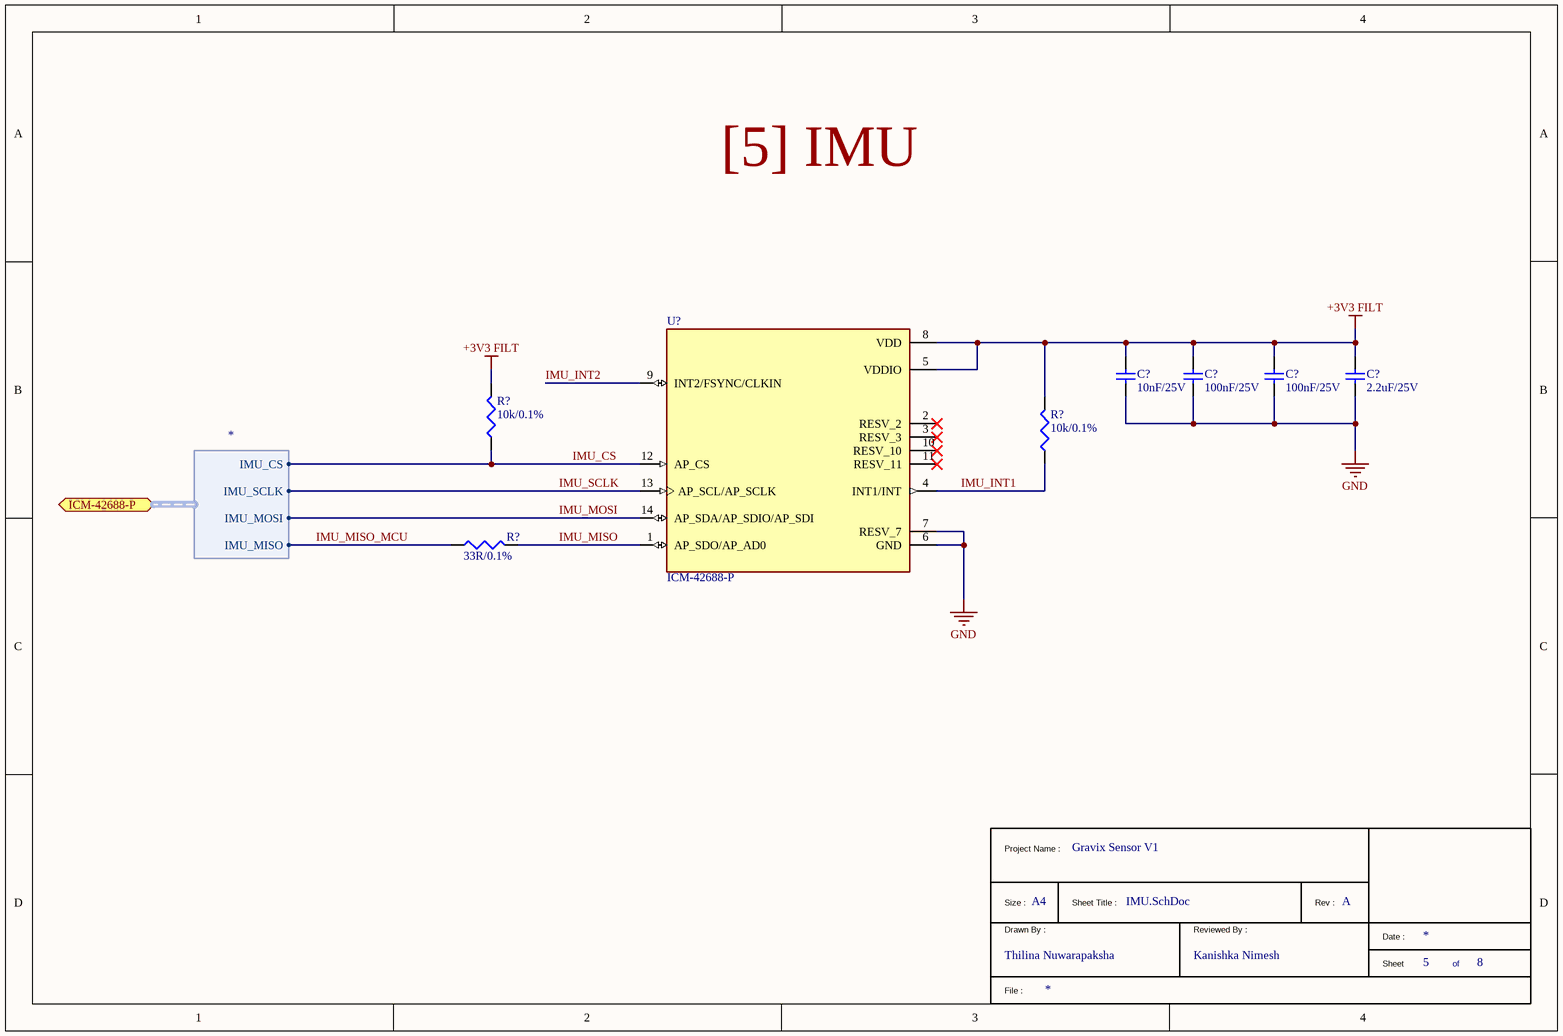
[diagram p4: IMU.SchDoc]

### Parts
(Parts that share a designator on the sheet are numbered #1, #2 ... from top to bottom, then left to right.)
*#5  TitleBlock1  (value not drawn)  (graphical)
C?#20  10nF/25V  [CAP_0402]
C?#21  100nF/25V  [CAP_0402]
C?#22  100nF/25V  [CAP_0402]
C?#23  2.2uF/25V  [CAP_0805]
R?#22  10k/0.1%  [RES_0402]
R?#23  10k/0.1%  [RES_0402]
R?#24  33R/0.1%  [RES_0402]
U?#7  ICM-42688-P  [ICM-42688-P_LGA-14(2.5x3)]

### Ports
ICM-42688-P (bidir, harness *)

### Harnesses
*: IMU_CS, IMU_SCLK, IMU_MOSI, IMU_MISO

### Nets
+3V3 FILT: C?#20.2 C?#21.2 C?#22.2 C?#23.2 R?#22.2 R?#23.2 U?#7.5(VDDIO) U?#7.8(VDD)
GND: C?#20.1 C?#21.1 C?#22.1 C?#23.1 U?#7.6(GND) U?#7.7(RESV_7)
IMU_CS: R?#22.1 U?#7.12(AP_CS) ; port ICM-42688-P.IMU_CS
IMU_INT1: R?#23.1 U?#7.4(INT1/INT)
IMU_INT2: U?#7.9(INT2/FSYNC/CLKIN)
IMU_MISO: R?#24.2 U?#7.1(AP_SDO/AP_AD0)
IMU_MISO_MCU: R?#24.1 ; port ICM-42688-P.IMU_MISO
IMU_MOSI: U?#7.14(AP_SDA/AP_SDIO/AP_SDI) ; port ICM-42688-P.IMU_MOSI
IMU_SCLK: U?#7.13(AP_SCL/AP_SCLK) ; port ICM-42688-P.IMU_SCLK

Not connected (* = marked no-connect by the designer): U?#7 2(RESV_2)* 3(RESV_3)* 10(RESV_10)* 11(RESV_11)*

### Notes on the sheet
- [5] IMU
- (in symbol TitleBlock1) Project Name :; Size :; Sheet Title :; Rev :; Drawn By :; Reviewed By :; Date :; Sheet; of; File :

### Library data of the parts
C?#20 = YAGEO CC0402JRX7R8BB103: 10nF ±5% 25V Ceramic Capacitor X7R 0402; Manufacturer: YAGEO; Manufacturer Part Number: CC0402JRX7R8BB103; LCSC Part Number: C541443; Package: 0402; Mounting Type: SMD; ComponentLink2Description: Digikey Link; ComponentLink3Description: LCSC Link; ComponentLink3URL: https://www.lcsc.com/product-detail/C541443.html?spm=wm.fly.bg.0.xh___wm.sy.dhl.mly.12-0-4&lcsc_vid=QlAIX1RQQQJfX1VRTwcNAQJXTlRaUQBVEQBYAwJfFFcxVlNRT1BcUFBQTlRYVTtW
C?#21 C?#22 = YAGEO CC0402JRX7R8BB104: as C?#1 on sheet Power; Manufacturer Part Number: CC0402JRX7R8BB104; LCSC Part Number: C541465; Package: 0402; Mounting Type: SMD; ComponentLink2Description: Digikey Link; ComponentLink3Description: LCSC Link; ComponentLink3URL: https://www.lcsc.com/product-detail/C541465.html?spm=wm.fly.bg.0.xh___wm.fly.dhl.mly.12-0-4&lcsc_vid=QlAIX1RQQQJfX1VRTwcNAQJXTlRaUQBVEQBYAwJfFFcxVlNRQFhYU1xWRFVdXztW
C?#23 = YAGEO CC0805KKX7R8BB225: as C?#14 on sheet Barometer; Manufacturer Part Number: CC0805KKX7R8BB225; LCSC Part Number: C277470; Package: 0805; Mounting Type: SMD; ComponentLink2Description: Digikey Link; ComponentLink3Description: LCSC Link; ComponentLink3URL: https://www.lcsc.com/product-detail/C277470.html?spm=wm.fly.bg.0.xh___wm.sy.dhl.mly.12-0-4&lcsc_vid=QlAIX1RQQQJfX1VRTwcNAQJXTlRaUQBVEQBYAwJfFFcxVlNRT1BcUFBQTlRYVTtW
R?#22 R?#23 = YAGEO RT0402BRD0710KL: as R?#1 on sheet Power; Manufacturer Part Number: RT0402BRD0710KL; LCSC Part Number: C190095; Package: 0402; ComponentLink1Description: Digikey Link; Mounting Type: SMD; ComponentLink2Description: LCSC Link; ComponentLink2URL: https://www.lcsc.com/product-detail/C190095.html?spm=wm.fly.bg.0.xh___wm.fly.dhl.mly.12-6-1&lcsc_vid=QlAIX1RQQQJfX1VRTwcNAQJXTlRaUQBVEQBYAwJfFFcxVlNRT1FbV1FfR1JZUDsOAxUeFF5JWBYZEEoKFBINSQcJGk4dAgUUFAk%3D
R?#24 = YAGEO RT0402BRD0733RL: as R?#12 on sheet Barometer; Manufacturer Part Number: RT0402BRD0733RL; LCSC Part Number: C852729; Package: 0402; ComponentLink1Description: Digikey Link; Mounting Type: SMD; ComponentLink2Description: LCSC Link; ComponentLink2URL: https://www.lcsc.com/product-detail/C852729.html?spm=wm.fly.bg.0.xh___wm.fly.dhl.mly.12-6-1&lcsc_vid=QlAIX1RQQQJfX1VRTwcNAQJXTlRaUQBVEQBYAwJfFFcxVlNRT1BXUFVTRlNXVDtW
U?#7 = TDK InvenSense ICM-42688-P: LGA-14(2.5x3) IMUs (Inertial Measurement Units) RoHS; Manufacturer: TDK InvenSense; Manufacturer Part Number: ICM-42688-P; LCSC Part Number: C1850418; Package: LGA-14(2.5x3); Mounting Type: SMD; ComponentLink2Description: Digikey Link; ComponentLink3Description: LCSC Link; ComponentLink3URL: https://www.lcsc.com/product-detail/C1850418.html?s_z=n_q_C1850418%2520&spm=wm.ssy.bg.0.xh&lcsc_vid=QlAIX1RQQQJfX1VRTwcNAQJXTlRaUQBVEQBYAwJfFFcxVlNRT1FaXlVVTlFdUDsOAxUeFF5JWBYZEEoKFBINSQcJGk4eFQsCAgIaSgADAwAHC0slTlZbVVZIHxUDCw%3D%3D

## Sheet Magnetometer.SchDoc: Gravix Sensor V1
size A4; SheetNumber: 7; SheetTotal: 8
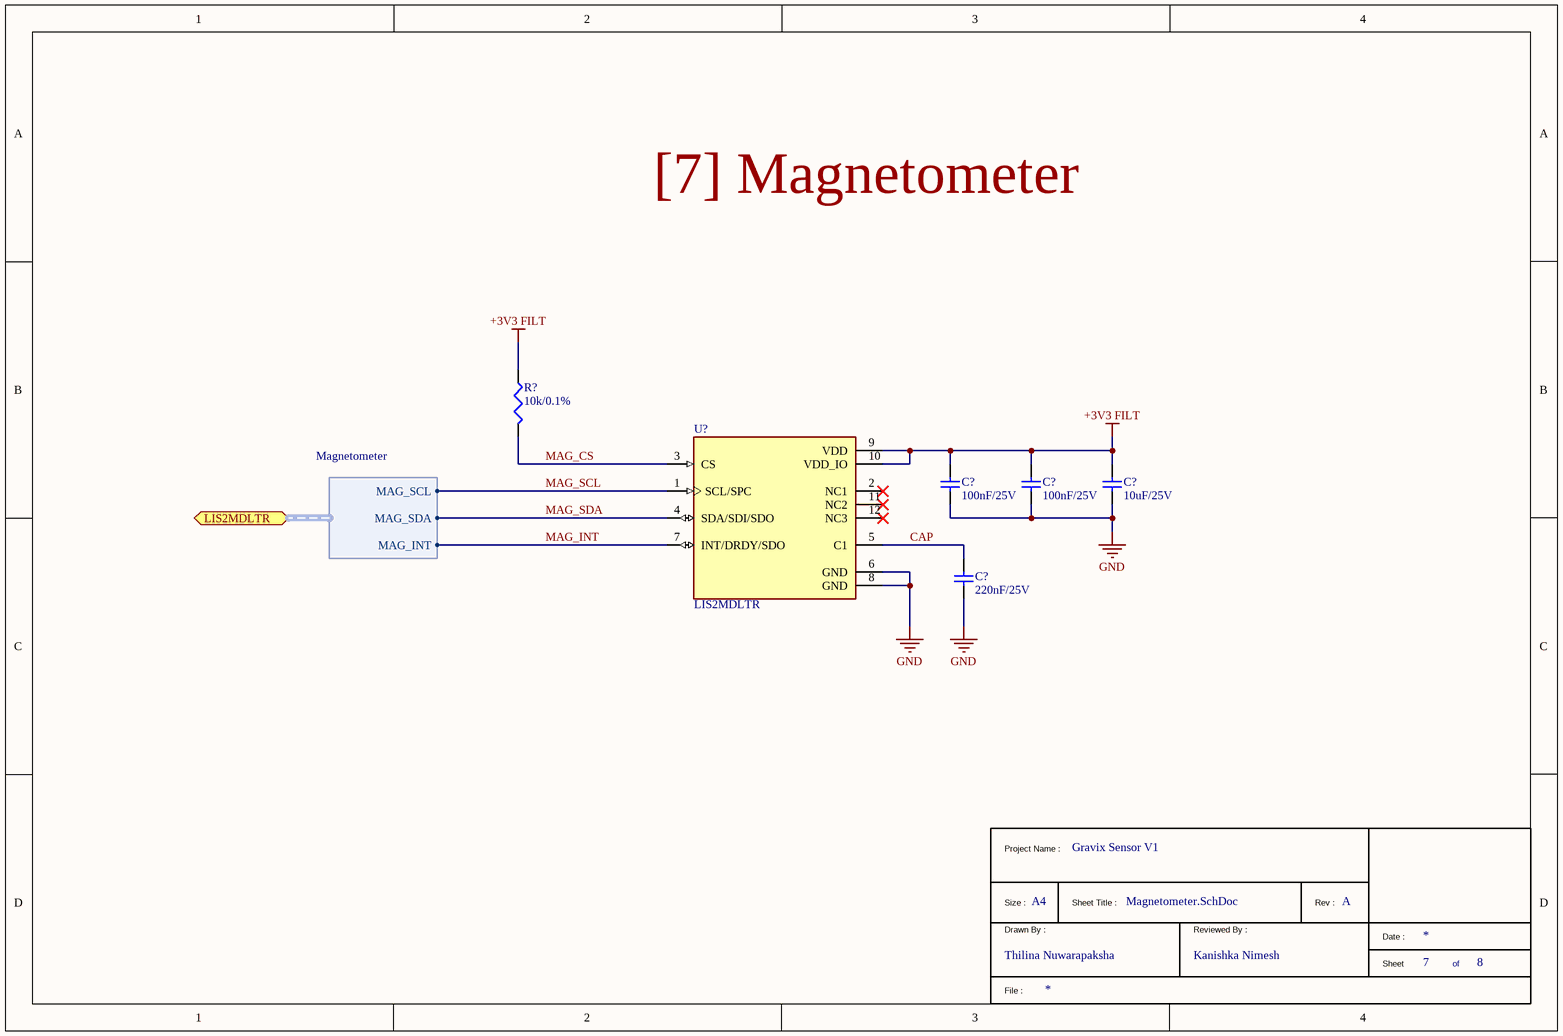
[diagram p5: Magnetometer.SchDoc]

### Parts
(Parts that share a designator on the sheet are numbered #1, #2 ... from top to bottom, then left to right.)
*#6  TitleBlock1  (value not drawn)  (graphical)
C?#24  100nF/25V  [CAP_0402]
C?#25  100nF/25V  [CAP_0402]
C?#26  10uF/25V  [CAP_1206]
C?#27  220nF/25V  [CAP_0402]
R?#25  10k/0.1%  [RES_0402]
U?#8  LIS2MDLTR  [LIS2MDLTR_LGA-12(2x2)]

### Ports
LIS2MDLTR (bidir, harness Magnetometer)

### Harnesses
Magnetometer: MAG_SCL, MAG_SDA, MAG_INT

### Nets
+3V3 FILT: C?#24.2 C?#25.2 C?#26.2 R?#25.1 U?#8.9(VDD) U?#8.10(VDD_IO)
GND: C?#24.1 C?#25.1 C?#26.1 C?#27.1 U?#8.6(GND) U?#8.8(GND)
CAP: C?#27.2 U?#8.5(C1)
MAG_CS: R?#25.2 U?#8.3(CS)
MAG_INT: U?#8.7(INT/DRDY/SDO) ; port LIS2MDLTR.MAG_INT
MAG_SCL: U?#8.1(SCL/SPC) ; port LIS2MDLTR.MAG_SCL
MAG_SDA: U?#8.4(SDA/SDI/SDO) ; port LIS2MDLTR.MAG_SDA

Not connected (* = marked no-connect by the designer): U?#8 2(NC1)* 11(NC2)* 12(NC3)*

### Notes on the sheet
- [7] Magnetometer
- (in symbol TitleBlock1) Project Name :; Size :; Sheet Title :; Rev :; Drawn By :; Reviewed By :; Date :; Sheet; of; File :

### Library data of the parts
C?#24 C?#25 = YAGEO CC0402JRX7R8BB104: as C?#1 on sheet Power; Manufacturer Part Number: CC0402JRX7R8BB104; LCSC Part Number: C541465; Package: 0402; Mounting Type: SMD; ComponentLink2Description: Digikey Link; ComponentLink3Description: LCSC Link; ComponentLink3URL: https://www.lcsc.com/product-detail/C541465.html?spm=wm.fly.bg.0.xh___wm.fly.dhl.mly.12-0-4&lcsc_vid=QlAIX1RQQQJfX1VRTwcNAQJXTlRaUQBVEQBYAwJfFFcxVlNRQFhYU1xWRFVdXztW
C?#26 = muRata GRM31CR71E106KA12L: as C?#2 on sheet Power; Manufacturer Part Number: GRM31CR71E106KA12L; LCSC Part Number: C77093; Package: 1206; Mounting Type: SMD; ComponentLink2Description: Digikey Link; ComponentLink3Description: LCSC Link; ComponentLink3URL: https://www.lcsc.com/product-detail/C77093.html?spm=wm.fly.bg.1.xh___wm.sxq.dhl.mly.12-0-4&lcsc_vid=QlAIX1RQQQJfX1VRTwcNAQJXTlRaUQBVEQBYAwJfFFcxVlNRT1FaUl1VQVZcUDsOAxUeFF5JWBYZEEoKFBINSQcJGk4%3D
C?#27 = YAGEO CC0402KRX7R8BB224: 220nF ±10% 25V Ceramic Capacitor X7R 0402; Manufacturer: YAGEO; Manufacturer Part Number: CC0402KRX7R8BB224; LCSC Part Number: C723566; Package: 0402; Mounting Type: SMD; ComponentLink2Description: Digikey Link; ComponentLink3Description: LCSC Link; ComponentLink3URL: https://www.lcsc.com/product-detail/C723566.html?spm=wm.fly.bg.0.xh___wm.sy.dhl.mly.12-0-4&lcsc_vid=QlAIX1RQQQJfX1VRTwcNAQJXTlRaUQBVEQBYAwJfFFcxVlNRT1BcUFBQTlRYVTtW
R?#25 = YAGEO RT0402BRD0710KL: as R?#1 on sheet Power; Manufacturer Part Number: RT0402BRD0710KL; LCSC Part Number: C190095; Package: 0402; ComponentLink1Description: Digikey Link; Mounting Type: SMD; ComponentLink2Description: LCSC Link; ComponentLink2URL: https://www.lcsc.com/product-detail/C190095.html?spm=wm.fly.bg.0.xh___wm.fly.dhl.mly.12-6-1&lcsc_vid=QlAIX1RQQQJfX1VRTwcNAQJXTlRaUQBVEQBYAwJfFFcxVlNRT1FbV1FfR1JZUDsOAxUeFF5JWBYZEEoKFBINSQcJGk4dAgUUFAk%3D
U?#8 = ST LIS2MDLTR: Digital output magnetic sensor: ultra-low-power, high-performance 3-axis magnetometer; Manufacturer: ST; Manufacturer Part Number: LIS2MDLTR; LCSC Part Number: C919695; Package: LGA-12(2x2); Mounting Type: SMD; ComponentLink2Description: Digikey Link; ComponentLink3Description: LCSC Link; ComponentLink3URL: https://www.lcsc.com/product-detail/C919695.html?s_z=n_q_C919695

## Sheet MCU.SchDoc: Gravix Sensor V1
size A3; CheckedBy: Kanishka Nimesh; DrawnBy: Thilina Nuwarapaksha; Revision: A; SheetNumber: 2; SheetTotal: 8
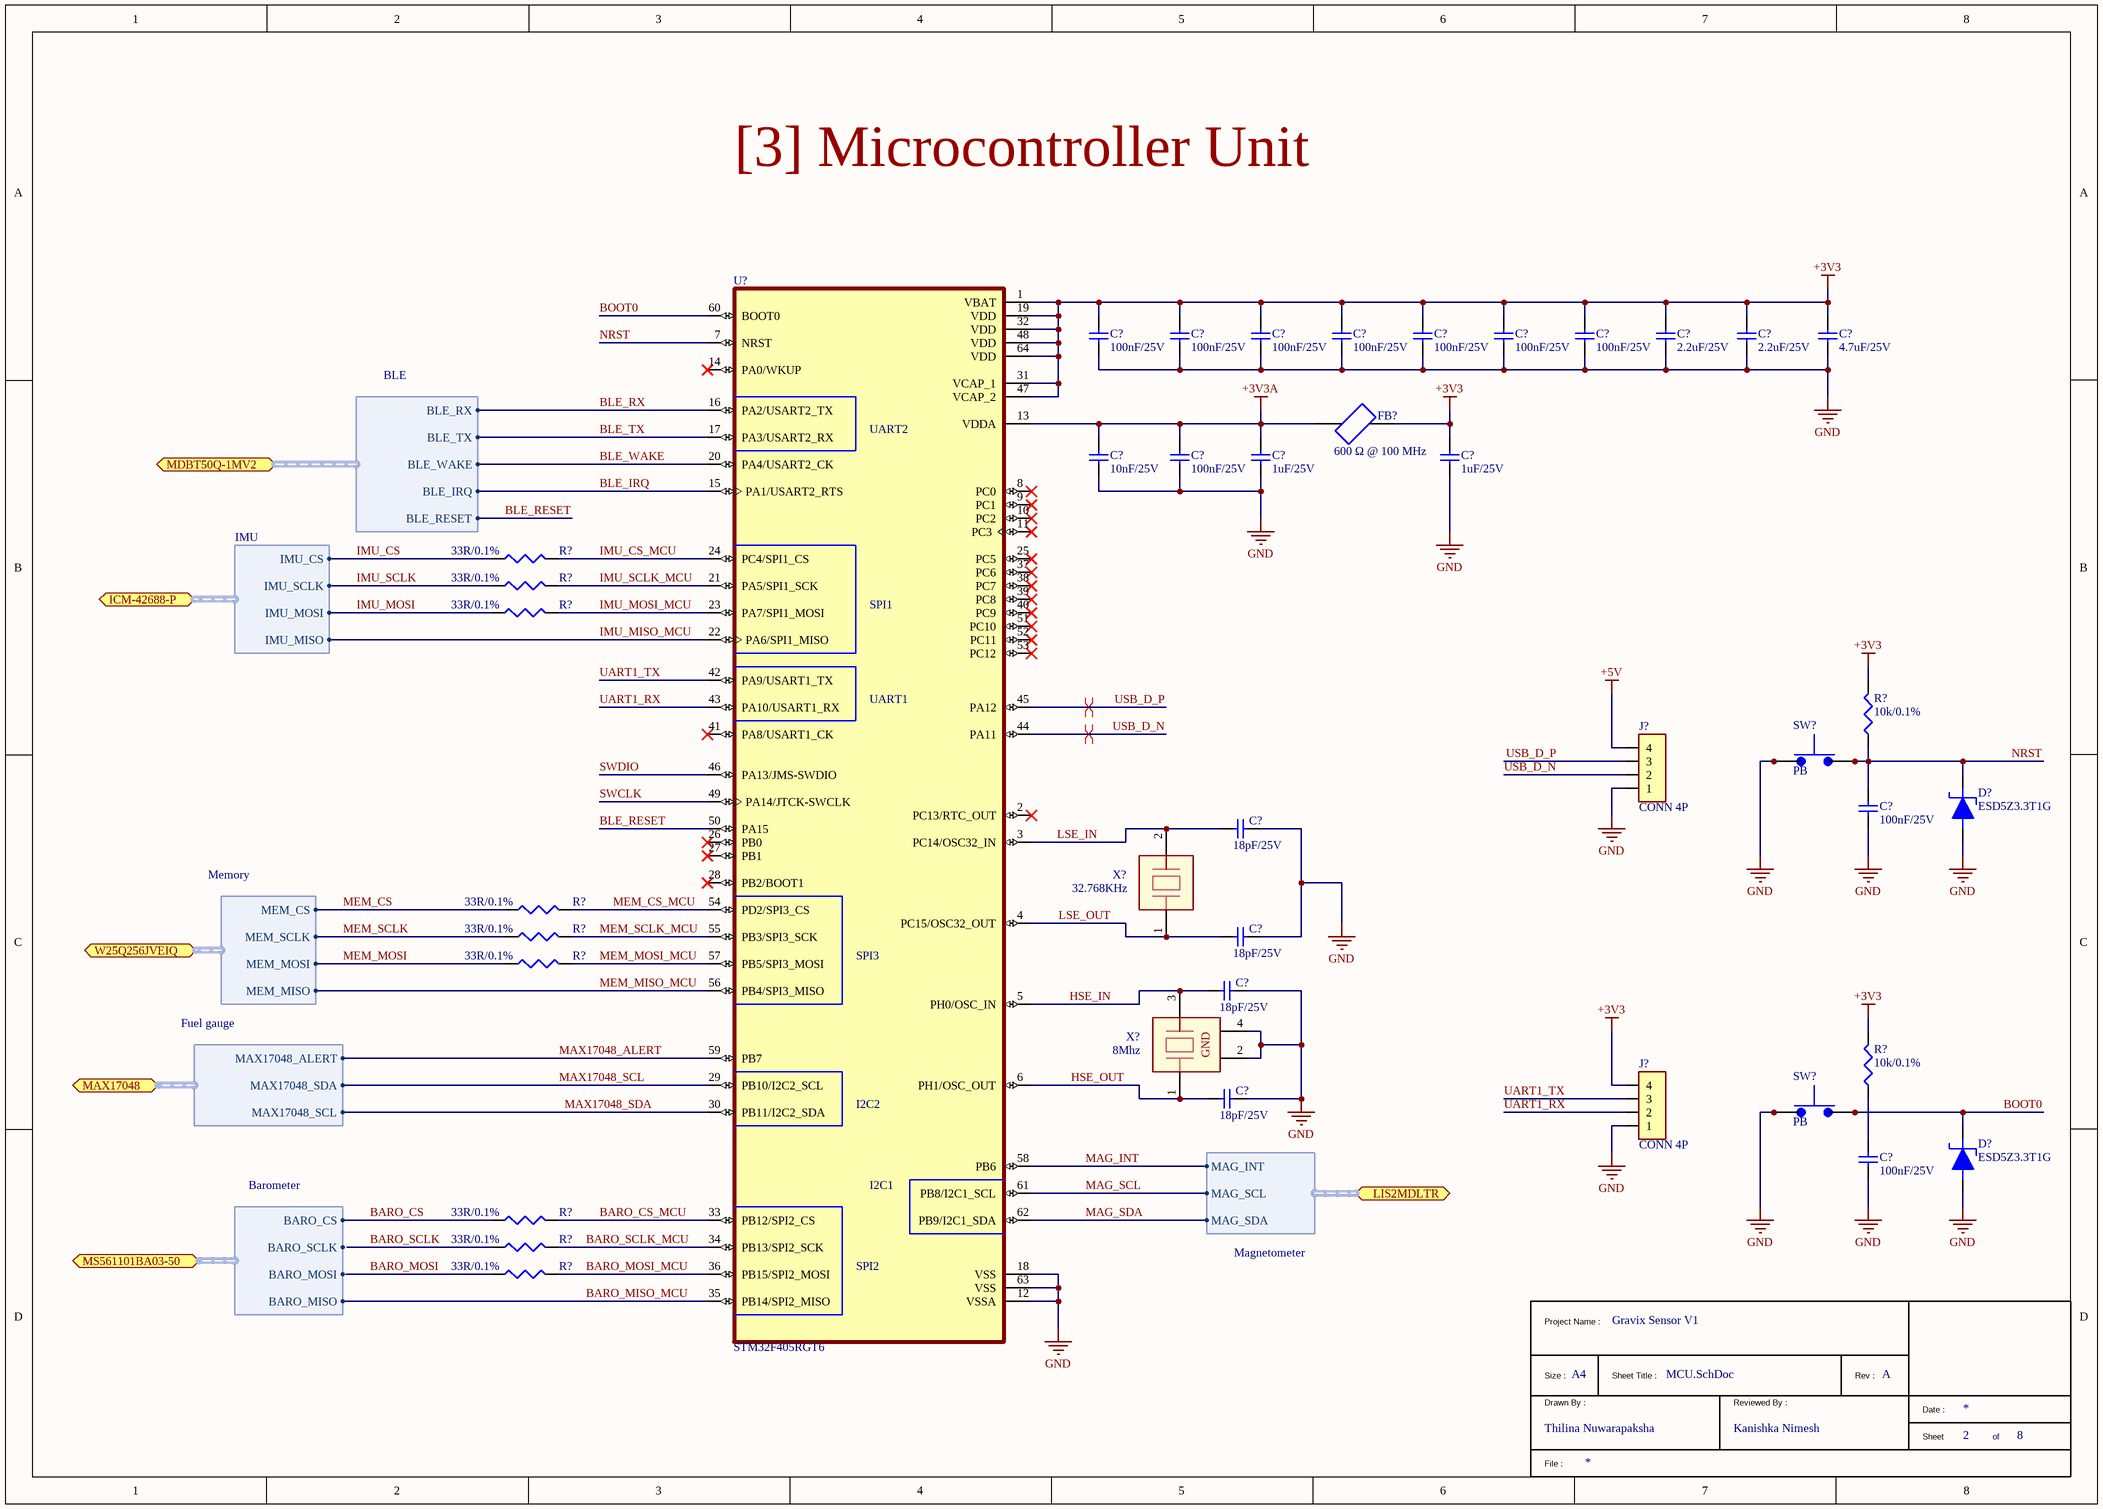
[diagram p6: MCU.SchDoc]

### Parts
(Parts that share a designator on the sheet are numbered #1, #2 ... from top to bottom, then left to right.)
*#7  TitleBlock1  (value not drawn)  (graphical)
C?#28  100nF/25V  [CAP_0402]
C?#29  100nF/25V  [CAP_0402]
C?#30  100nF/25V  [CAP_0402]
C?#31  100nF/25V  [CAP_0402]
C?#32  100nF/25V  [CAP_0402]
C?#33  100nF/25V  [CAP_0402]
C?#34  100nF/25V  [CAP_0402]
C?#35  2.2uF/25V  [CAP_0805]
C?#36  2.2uF/25V  [CAP_0805]
C?#37  4.7uF/25V  [CAP_0805]
C?#38  10nF/25V  [CAP_0402]
C?#39  100nF/25V  [CAP_0402]
C?#40  1uF/25V  [CAP_0805]
C?#41  1uF/25V  [CAP_0805]
C?#42  18pF/25V  [CAP_0402]
C?#43  100nF/25V  [CAP_0402]
C?#44  18pF/25V  [CAP_0402]
C?#45  18pF/25V  [CAP_0402]
C?#46  18pF/25V  [CAP_0402]
C?#47  100nF/25V  [CAP_0402]
D?#6  ESD5Z3.3T1G  [ESD5Z3.3T1G_SOD-523]
D?#7  ESD5Z3.3T1G  [ESD5Z3.3T1G_SOD-523]
FB?  600 Ω @ 100 MHz  [FB_1206]
J?#2  CONN 4P  [JST_SH_1.00]
J?#3  CONN 4P  [JST_SH_1.00]
R?#26  33R/0.1%  [RES_0402]
R?#27  33R/0.1%  [RES_0402]
R?#28  33R/0.1%  [RES_0402]
R?#29  10k/0.1%  [RES_0402]
R?#30  33R/0.1%  [RES_0402]
R?#31  33R/0.1%  [RES_0402]
R?#32  33R/0.1%  [RES_0402]
R?#33  10k/0.1%  [RES_0402]
R?#34  33R/0.1%  [RES_0402]
R?#35  33R/0.1%  [RES_0402]
R?#36  33R/0.1%  [RES_0402]
SW?#1  PB  [ALPSALPINE SKRPABE010]
SW?#2  PB  [ALPSALPINE SKRPABE010]
U?#9  STM32F405RGT6  [STM32F405RGT6_LQFP-64]
X?#2  32.768KHz  [32.768KHz_SMD2012-2P]
X?#3  8Mhz  [8MHz_SMD3225-4P]

### Ports
ICM-42688-P (bidir, harness IMU, see Block Diagram[3B], IMU[1B]), LIS2MDLTR (bidir, harness Magnetometer, see Block Diagram[3C], Magnetometer[1C]), MAX17048 (bidir, harness Fuel gauge, see Block Diagram[2B], Power[5D]), MDBT50Q-1MV2 (bidir, harness BLE, see Block Diagram[2C], BLE[3C]), MS561101BA03-50 (bidir, harness Barometer, see Block Diagram[3C], Barometer[1B]), W25Q256JVEIQ (bidir, harness Memory, see Block Diagram[2C], Memory[1B])

### Harnesses
IMU: IMU_CS, IMU_SCLK, IMU_MOSI, IMU_MISO
Memory: MEM_SCLK, MEM_MOSI, MEM_CS, MEM_MISO
Fuel gauge: MAX17048_SCL, MAX17048_SDA, MAX17048_ALERT
Magnetometer: MAG_SCL, MAG_SDA, MAG_INT
Barometer: BARO_CS, BARO_SCLK, BARO_MOSI, BARO_MISO
BLE: BLE_TX, BLE_RX, BLE_WAKE, BLE_RESET, BLE_IRQ

### Nets
+3V3: C?#28.2 C?#29.2 C?#30.2 C?#31.2 C?#32.2 C?#33.2 C?#34.2 C?#35.2 C?#36.2 C?#37.2 C?#41.2 FB?.2 J?#3.4 R?#29.2 R?#33.2 U?#9.1(VBAT) U?#9.19(VDD) U?#9.31(VCAP_1) U?#9.32(VDD) U?#9.47(VCAP_2) U?#9.48(VDD) U?#9.64(VDD)
+3V3A: C?#38.2 C?#39.2 C?#40.2 FB?.1 U?#9.13(VDDA)
+5V: J?#2.4
GND: C?#28.1 C?#29.1 C?#30.1 C?#31.1 C?#32.1 C?#33.1 C?#34.1 C?#35.1 C?#36.1 C?#37.1 C?#38.1 C?#39.1 C?#40.1 C?#41.1 C?#42.2 C?#43.1 C?#44.2 C?#45.2 C?#46.2 C?#47.1 D?#6.2 D?#7.2 J?#2.1 J?#3.1 SW?#1.1 SW?#1.2 SW?#2.1 SW?#2.2 U?#9.12(VSSA) U?#9.18(VSS) U?#9.63(VSS) X?#3.2(GND) X?#3.4(GND)
BARO_CS: R?#34.1 ; port MS561101BA03-50.BARO_CS
BARO_CS_MCU: R?#34.2 U?#9.33(PB12/SPI2_CS)
BARO_MISO_MCU: U?#9.35(PB14/SPI2_MISO)
BARO_MOSI: R?#36.1
BARO_MOSI_MCU: R?#36.2 U?#9.36(PB15/SPI2_MOSI)
BARO_SCLK: R?#35.1
BARO_SCLK_MCU: R?#35.2 U?#9.34(PB13/SPI2_SCK)
BLE_IRQ: U?#9.15(PA1/USART2_RTS) ; port MDBT50Q-1MV2.BLE_IRQ
BLE_RESET: U?#9.50(PA15) ; port MDBT50Q-1MV2.BLE_RESET
BLE_RX: U?#9.16(PA2/USART2_TX) ; port MDBT50Q-1MV2.BLE_RX
BLE_TX: U?#9.17(PA3/USART2_RX) ; port MDBT50Q-1MV2.BLE_TX
BLE_WAKE: U?#9.20(PA4/USART2_CK) ; port MDBT50Q-1MV2.BLE_WAKE
BOOT0: D?#7.1 SW?#2.3 SW?#2.4 U?#9.60(BOOT0)
HSE_IN: C?#45.1 U?#9.5(PH0/OSC_IN) X?#3.3
HSE_OUT: C?#46.1 U?#9.6(PH1/OSC_OUT) X?#3.1
IMU_CS: R?#26.1 ; port ICM-42688-P.IMU_CS
IMU_CS_MCU: R?#26.2 U?#9.24(PC4/SPI1_CS)
IMU_MISO_MCU: U?#9.22(PA6/SPI1_MISO) ; port ICM-42688-P.IMU_MISO
IMU_MOSI: R?#28.1 ; port ICM-42688-P.IMU_MOSI
IMU_MOSI_MCU: R?#28.2 U?#9.23(PA7/SPI1_MOSI)
IMU_SCLK: R?#27.1 ; port ICM-42688-P.IMU_SCLK
IMU_SCLK_MCU: R?#27.2 U?#9.21(PA5/SPI1_SCK)
LSE_IN: C?#42.1 U?#9.3(PC14/OSC32_IN) X?#2.2(GND)
LSE_OUT: C?#44.1 U?#9.4(PC15/OSC32_OUT) X?#2.1
MAG_INT: U?#9.58(PB6) ; port LIS2MDLTR.MAG_INT
MAG_SCL: U?#9.61(PB8/I2C1_SCL) ; port LIS2MDLTR.MAG_SCL
MAG_SDA: U?#9.62(PB9/I2C1_SDA) ; port LIS2MDLTR.MAG_SDA
MAX17048_ALERT: U?#9.59(PB7) ; port MAX17048.MAX17048_ALERT
MAX17048_SCL: U?#9.29(PB10/I2C2_SCL) ; port MAX17048.MAX17048_SDA
MAX17048_SDA: U?#9.30(PB11/I2C2_SDA) ; port MAX17048.MAX17048_SCL  [project net MAX17048_SCL]
MEM_CS: R?#30.1 ; port W25Q256JVEIQ.MEM_CS
MEM_CS_MCU: R?#30.2 U?#9.54(PD2/SPI3_CS)
MEM_MISO_MCU: U?#9.56(PB4/SPI3_MISO) ; port W25Q256JVEIQ.MEM_MISO
MEM_MOSI: R?#32.1 ; port W25Q256JVEIQ.MEM_MOSI
MEM_MOSI_MCU: R?#32.2 U?#9.57(PB5/SPI3_MOSI)
MEM_SCLK: R?#31.1 ; port W25Q256JVEIQ.MEM_SCLK
MEM_SCLK_MCU: R?#31.2 U?#9.55(PB3/SPI3_SCK)
NRST: C?#43.2 D?#6.1 R?#29.1 SW?#1.3 SW?#1.4 U?#9.7(NRST)
SWCLK: U?#9.49(PA14/JTCK-SWCLK)
SWDIO: U?#9.46(PA13/JMS-SWDIO)
UART1_RX: J?#3.2 U?#9.43(PA10/USART1_RX)
UART1_TX: J?#3.3 U?#9.42(PA9/USART1_TX)
USB_D_N: J?#2.2 U?#9.44(PA11)
USB_D_P: J?#2.3 U?#9.45(PA12)
NetC?#47_2: C?#47.2 R?#33.1

Not connected (* = marked no-connect by the designer): U?#9 2(PC13/RTC_OUT)* 8(PC0)* 9(PC1)* 10(PC2)* 11(PC3)* 14(PA0/WKUP)* 25(PC5)* 26(PB0)* 27(PB1)* 28(PB2/BOOT1)* 37(PC6)* 38(PC7)* 39(PC8)* 40(PC9)* 41(PA8/USART1_CK)* 51(PC10)* 52(PC11)* 53(PC12)*

### Layout directives
differential pair: USB_D_N, USB_D_P

### Notes on the sheet
- [3] Microcontroller Unit
- (in symbol ST STM32F405RGT6) UART2; SPI1; UART1; SPI3; I2C2; I2C1; SPI2
- (in symbol TitleBlock1) Project Name :; Size :; Sheet Title :; Rev :; Drawn By :; Reviewed By :; Date :; Sheet; of; File :

### Library data of the parts
C?#28-C?#34 C?#39 C?#43 C?#47 = YAGEO CC0402JRX7R8BB104: as C?#1 on sheet Power; Manufacturer Part Number: CC0402JRX7R8BB104; LCSC Part Number: C541465; Package: 0402; Mounting Type: SMD; ComponentLink2Description: Digikey Link; ComponentLink3Description: LCSC Link; ComponentLink3URL: https://www.lcsc.com/product-detail/C541465.html?spm=wm.fly.bg.0.xh___wm.fly.dhl.mly.12-0-4&lcsc_vid=QlAIX1RQQQJfX1VRTwcNAQJXTlRaUQBVEQBYAwJfFFcxVlNRQFhYU1xWRFVdXztW
C?#35 C?#36 = YAGEO CC0805KKX7R8BB225: as C?#14 on sheet Barometer; Manufacturer Part Number: CC0805KKX7R8BB225; LCSC Part Number: C277470; Package: 0805; Mounting Type: SMD; ComponentLink2Description: Digikey Link; ComponentLink3Description: LCSC Link; ComponentLink3URL: https://www.lcsc.com/product-detail/C277470.html?spm=wm.fly.bg.0.xh___wm.sy.dhl.mly.12-0-4&lcsc_vid=QlAIX1RQQQJfX1VRTwcNAQJXTlRaUQBVEQBYAwJfFFcxVlNRT1BcUFBQTlRYVTtW
C?#37 = YAGEO CC0805KKX7R8BB475: 4.7uF ±10% 25V Ceramic Capacitor X7R 0805; Manufacturer: YAGEO; Manufacturer Part Number: CC0805KKX7R8BB475; LCSC Part Number: C354262; Package: 0805; Mounting Type: SMD; ComponentLink2Description: Digikey Link; ComponentLink3Description: LCSC Link; ComponentLink3URL: https://www.lcsc.com/product-detail/C354262.html?spm=wm.fly.bg.0.xh___wm.sy.dhl.mly.12-0-4&lcsc_vid=QlAIX1RQQQJfX1VRTwcNAQJXTlRaUQBVEQBYAwJfFFcxVlNRT1BXUFVTRlNXVDtW
C?#38 = YAGEO CC0402JRX7R8BB103: as C?#20 on sheet IMU; Manufacturer Part Number: CC0402JRX7R8BB103; LCSC Part Number: C541443; Package: 0402; Mounting Type: SMD; ComponentLink2Description: Digikey Link; ComponentLink3Description: LCSC Link; ComponentLink3URL: https://www.lcsc.com/product-detail/C541443.html?spm=wm.fly.bg.0.xh___wm.sy.dhl.mly.12-0-4&lcsc_vid=QlAIX1RQQQJfX1VRTwcNAQJXTlRaUQBVEQBYAwJfFFcxVlNRT1BcUFBQTlRYVTtW
C?#40 C?#41 = YAGEO CC0805KKX7R8BB105: as C?#3 on sheet Power; Manufacturer Part Number: CC0805KKX7R8BB105; LCSC Part Number: C91186; Package: 0805; Mounting Type: SMD; ComponentLink2Description: Digikey Link; ComponentLink3Description: LCSC Link; ComponentLink3URL: https://www.lcsc.com/product-detail/C91186.html?spm=wm.fly.bg.0.xh___wm.fly.dhl.mly.12-0-4&lcsc_vid=QlAIX1RQQQJfX1VRTwcNAQJXTlRaUQBVEQBYAwJfFFcxVlNRT1FbV1FfR1JZUDsOAxUeFF5JWBYZEEoKFBINSQcJGk4dAgUUFAk%3D
C?#42 C?#44-C?#46 = YAGEO CC0402GRNPO8BN180: as C?#15 on sheet BLE; Manufacturer Part Number: CC0402GRNPO8BN180; LCSC Part Number: C526984; Package: 0402; Mounting Type: SMD; ComponentLink2Description: Digikey Link; ComponentLink3Description: LCSC Link; ComponentLink3URL: https://www.lcsc.com/product-detail/C526984.html?spm=wm.fly.bg.0.xh___wm.fly.dhl.mly.12-0-4&lcsc_vid=QlAIX1RQQQJfX1VRTwcNAQJXTlRaUQBVEQBYAwJfFFcxVlNRQFhYU1xWRFVdXztW
D?#6 D?#7 = onsemi ESD5Z3.3T1G: TVS DIODE 3.3VWM 14.1VC SOD-523; Manufacturer: onsemi; Manufacturer Part Number: ESD5Z3.3T1G; LCSC Part Number: C61148; Package: SOD-523; ComponentLink1Description: Digikey Link; ComponentLink2Description: LCSC Link; ComponentLink2URL: https://www.lcsc.com/product-detail/C61148.html?s_z=n_ESD5Z3.3T1G; Mounting Type: SMD
FB? = TAI-TECH HCB3216KF-601T20: 600Ω@100MHz 1 Line Ferrite Bead 1206 1A 100mΩ; Manufacturer: TAI-TECH; Manufacturer Part Number: HCB3216KF-601T20; LCSC Part Number: C127295; Package: 1206; Mounting Type: SMD; ComponentLink2Description: Digikey Link; ComponentLink3Description: LCSC Link; ComponentLink3URL: https://www.lcsc.com/product-detail/C127295.html?spm=wm.fly.bg.0.xh&lcsc_vid=QlAIX1RQQQJfX1VRTwcNAQJXTlRaUQBVEQBYAwJfFFcxVlNRT1FaVFJTQVhWUjsOAxUeFF5JWBYZEEoBGA4JCwFIFA4DSA%3D%3D
J?#2 J?#3 = JST_4P_SH: as J?#1 on sheet BLE; LCSC Part Number: C160404; Package: SMD,P=1mm,Surface Mount,Right Angle; ComponentLink1Description: Digikey Link; Mounting Type: SMD; ComponentLink2Description: LCSC Link; ComponentLink2URL: https://www.lcsc.com/product-detail/C160404.html?spm=wm.fly.bg.0.xh&lcsc_vid=QlAIX1RQQQJfX1VRTwcNAQJXTlRaUQBVEQBYAwJfFFcxVlNRT1RYUldfQ1BaVTsOAxUeFF5JWBYZEEoKFBINSQcJGk4NBhADEA4cHktRTlNADxALGw%3D%3D
R?#26-R?#28 R?#30-R?#32 R?#34-R?#36 = YAGEO RT0402BRD0733RL: as R?#12 on sheet Barometer; Manufacturer Part Number: RT0402BRD0733RL; LCSC Part Number: C852729; Package: 0402; ComponentLink1Description: Digikey Link; Mounting Type: SMD; ComponentLink2Description: LCSC Link; ComponentLink2URL: https://www.lcsc.com/product-detail/C852729.html?spm=wm.fly.bg.0.xh___wm.fly.dhl.mly.12-6-1&lcsc_vid=QlAIX1RQQQJfX1VRTwcNAQJXTlRaUQBVEQBYAwJfFFcxVlNRT1BXUFVTRlNXVDtW
R?#29 R?#33 = YAGEO RT0402BRD0710KL: as R?#1 on sheet Power; Manufacturer Part Number: RT0402BRD0710KL; LCSC Part Number: C190095; Package: 0402; ComponentLink1Description: Digikey Link; Mounting Type: SMD; ComponentLink2Description: LCSC Link; ComponentLink2URL: https://www.lcsc.com/product-detail/C190095.html?spm=wm.fly.bg.0.xh___wm.fly.dhl.mly.12-6-1&lcsc_vid=QlAIX1RQQQJfX1VRTwcNAQJXTlRaUQBVEQBYAwJfFFcxVlNRT1FbV1FfR1JZUDsOAxUeFF5JWBYZEEoKFBINSQcJGk4dAgUUFAk%3D
SW?#1 SW?#2 = ALPSALPINE SKRPABE010: Tactile Switch SPST 2.5mm 4.2mm x 3.2mm Surface Mount; Manufacturer: ALPSALPINE; Manufacturer Part Number: SKRPABE010; LCSC Part Number: C115360; Package: SMD-4P,4.2x3.2mm; ComponentLink1Description: Digikey Link; ComponentLink2Description: LCSC Link; ComponentLink2URL: https://www.lcsc.com/product-detail/C115360.html?s_z=n_C115360; Mounting Type: SMD
U?#9 = ST STM32F405RGT6: ARM Cortex-M4 32b MCU+FPU, 210DMIPS, up to 1MB Flash/192+4KB RAM, USB OTG HS/FS, Ethernet, 17 TIMs, 3 ADCs, 15 comm. interfaces & camera; Manufacturer: ST; Manufacturer Part Number: STM32F405RGT6; LCSC Part Number: C15742; Package: LQFP-64(10x10); Mounting Type: SMD; ComponentLink2Description: Digikey Link; ComponentLink3Description: LCSC Link; ComponentLink3URL: https://www.lcsc.com/product-detail/C15742.html?s_z=n_q_STM32F405RGT6&spm=wm.ssy.bg.0.xh&lcsc_vid=QlAIX1RQQQJfX1VRTwcNAQJXTlRaUQBVEQBYAwJfFFcxVlNRQFhZVVBQQ1RcXjsOAxUeFF5JWBYZEEoKFBINSQcJGk4NBhADEA4cHktXRlVcSQwSGg0%3D
X?#2 = 32.768KHz 2P: as X?#1 on sheet BLE; LCSC Part Number: C19076730; Package: SMD2012-2P; ComponentLink1Description: Digikey Link; ComponentLink2Description: LCSC Link; ComponentLink2URL: https://www.lcsc.com/product-detail/C19076730.html?spm=wm.fly.bg.2.xh___wm.sxq.dhl.mly.12-1-1&lcsc_vid=QlAIX1RQQQJfX1VRTwcNAQJXTlRaUQBVEQBYAwJfFFcxVlNRQFhYU1xWRFVdXztW; Mounting Type: SMD
X?#3 = 8MHz 4P: Crystal 8MHz ±10ppm 12pF 40Ω SMD3225-4P; Manufacturer: huaxindianzi; Manufacturer Part Number: CF4008M00012001; LCSC Part Number: C7294546; Package: SMD3225-4P; ComponentLink1Description: Digikey Link; ComponentLink2Description: LCSC Link; ComponentLink2URL: https://www.lcsc.com/product-detail/C7294546.html?spm=wm.fly.bg.0.xh___wm.sxq.dhl.mly.12-1-1&lcsc_vid=QlAIX1RQQQJfX1VRTwcNAQJXTlRaUQBVEQBYAwJfFFcxVlNRQFhYU1xWRFVdXztW; Mounting Type: SMD

## Sheet Memory.SchDoc: Gravix Sensor V1
size A; SheetNumber: 8; SheetTotal: 8
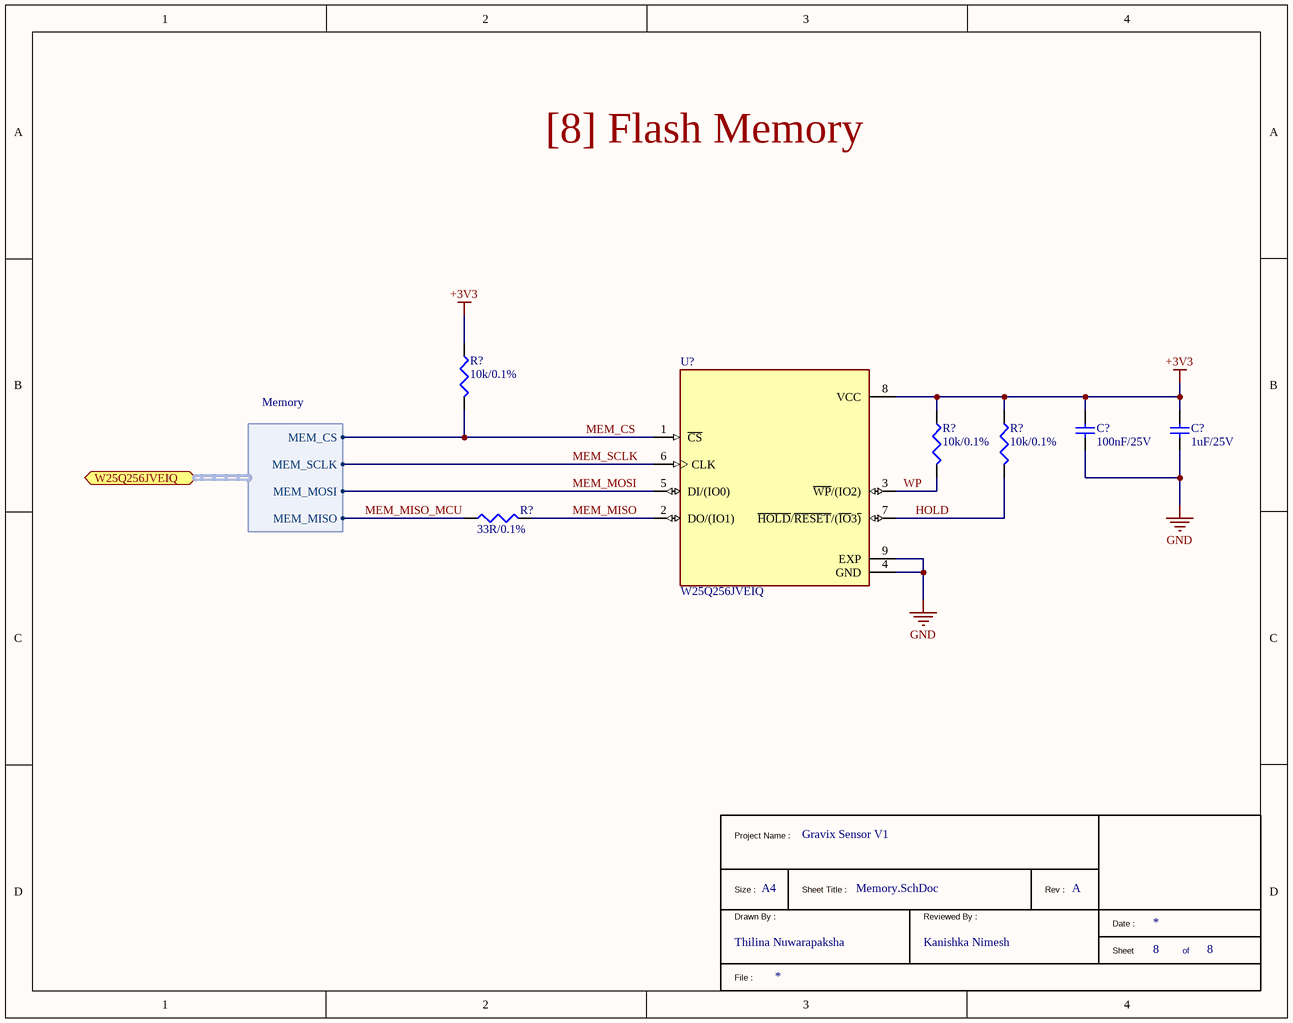
[diagram p7: Memory.SchDoc]

### Parts
(Parts that share a designator on the sheet are numbered #1, #2 ... from top to bottom, then left to right.)
*#8  TitleBlock1  (value not drawn)  (graphical)
C?#48  100nF/25V  [CAP_0402]
C?#49  1uF/25V  [CAP_0805]
R?#37  10k/0.1%  [RES_0402]
R?#38  10k/0.1%  [RES_0402]
R?#39  10k/0.1%  [RES_0402]
R?#40  33R/0.1%  [RES_0402]
U?#10  W25Q256JVEIQ  [W25Q256JVEIQ_WSON-8-EP(6x8)]

### Ports
W25Q256JVEIQ (bidir, harness Memory)

### Harnesses
Memory: MEM_SCLK, MEM_MOSI, MEM_CS, MEM_MISO

### Nets
+3V3: C?#48.2 C?#49.2 R?#37.1 R?#38.1 R?#39.1 U?#10.8(VCC)
GND: C?#48.1 C?#49.1 U?#10.4(GND) U?#10.9(EXP)
HOLD: R?#39.2 U?#10.7(~{HOLD}/~{RESET}/(~{IO}3~{)})
MEM_CS: R?#37.2 U?#10.1(~{CS}) ; port W25Q256JVEIQ.MEM_CS
MEM_MISO: R?#40.2 U?#10.2(DO/(IO1))
MEM_MISO_MCU: R?#40.1 ; port W25Q256JVEIQ.MEM_MISO
MEM_MOSI: U?#10.5(DI/(IO0)) ; port W25Q256JVEIQ.MEM_MOSI
MEM_SCLK: U?#10.6(CLK) ; port W25Q256JVEIQ.MEM_SCLK
WP: R?#38.2 U?#10.3(~{WP}/(IO2))

### Notes on the sheet
- [8] Flash Memory
- (in symbol TitleBlock1) Project Name :; Size :; Sheet Title :; Rev :; Drawn By :; Reviewed By :; Date :; Sheet; of; File :

### Library data of the parts
C?#48 = YAGEO CC0402JRX7R8BB104: as C?#1 on sheet Power; Manufacturer Part Number: CC0402JRX7R8BB104; LCSC Part Number: C541465; Package: 0402; Mounting Type: SMD; ComponentLink2Description: Digikey Link; ComponentLink3Description: LCSC Link; ComponentLink3URL: https://www.lcsc.com/product-detail/C541465.html?spm=wm.fly.bg.0.xh___wm.fly.dhl.mly.12-0-4&lcsc_vid=QlAIX1RQQQJfX1VRTwcNAQJXTlRaUQBVEQBYAwJfFFcxVlNRQFhYU1xWRFVdXztW
C?#49 = YAGEO CC0805KKX7R8BB105: as C?#3 on sheet Power; Manufacturer Part Number: CC0805KKX7R8BB105; LCSC Part Number: C91186; Package: 0805; Mounting Type: SMD; ComponentLink2Description: Digikey Link; ComponentLink3Description: LCSC Link; ComponentLink3URL: https://www.lcsc.com/product-detail/C91186.html?spm=wm.fly.bg.0.xh___wm.fly.dhl.mly.12-0-4&lcsc_vid=QlAIX1RQQQJfX1VRTwcNAQJXTlRaUQBVEQBYAwJfFFcxVlNRT1FbV1FfR1JZUDsOAxUeFF5JWBYZEEoKFBINSQcJGk4dAgUUFAk%3D
R?#37-R?#39 = YAGEO RT0402BRD0710KL: as R?#1 on sheet Power; Manufacturer Part Number: RT0402BRD0710KL; LCSC Part Number: C190095; Package: 0402; ComponentLink1Description: Digikey Link; Mounting Type: SMD; ComponentLink2Description: LCSC Link; ComponentLink2URL: https://www.lcsc.com/product-detail/C190095.html?spm=wm.fly.bg.0.xh___wm.fly.dhl.mly.12-6-1&lcsc_vid=QlAIX1RQQQJfX1VRTwcNAQJXTlRaUQBVEQBYAwJfFFcxVlNRT1FbV1FfR1JZUDsOAxUeFF5JWBYZEEoKFBINSQcJGk4dAgUUFAk%3D
R?#40 = YAGEO RT0402BRD0733RL: as R?#12 on sheet Barometer; Manufacturer Part Number: RT0402BRD0733RL; LCSC Part Number: C852729; Package: 0402; ComponentLink1Description: Digikey Link; Mounting Type: SMD; ComponentLink2Description: LCSC Link; ComponentLink2URL: https://www.lcsc.com/product-detail/C852729.html?spm=wm.fly.bg.0.xh___wm.fly.dhl.mly.12-6-1&lcsc_vid=QlAIX1RQQQJfX1VRTwcNAQJXTlRaUQBVEQBYAwJfFFcxVlNRT1BXUFVTRlNXVDtW
U?#10 = Winbond W25Q256JVEIQ: FLASH - NOR Memory IC 256Mbit SPI 133MHz WSON-8-EP(6x8); Manufacturer: Winbond; Manufacturer Part Number: W25Q256JVEIQ; LCSC Part Number: C97522; Package: WSON-8-EP(6x8); Mounting Type: SMD; ComponentLink2Description: Digikey Link; ComponentLink3Description: LCSC Link; ComponentLink3URL: https://www.lcsc.com/product-detail/C97522.html?s_z=n_q_C97522

## Nets that join several sheets
+3V3: Power (7 pins), BLE (6 pins), MCU (22 pins), Memory (6 pins)
+3V3 FILT: Barometer (C?#13.2 C?#14.2 R?#10.2 U?#5.1), IMU (8 pins), Magnetometer (6 pins)
+5V: Power (D?#1.2), MCU (J?#2.4)
GND: Power (30 pins), Barometer (C?#13.1 C?#14.1 R?#11.1 U?#5.3), BLE (11 pins), IMU (6 pins), Magnetometer (6 pins), MCU (33 pins), Memory (C?#48.1 C?#49.1 U?#10.4 U?#10.9)
BARO_CS: Barometer (R?#10.1 U?#5.4 U?#5.5), MCU (R?#34.1)
BLE_IRQ: BLE (R?#18.1), MCU (U?#9.15)
BLE_RESET: BLE (R?#17.1), MCU (U?#9.50)
BLE_RX: BLE (R?#14.1), MCU (U?#9.16)
BLE_TX: BLE (R?#13.1), MCU (U?#9.17)
BLE_WAKE: BLE (R?#16.1), MCU (U?#9.20)
IMU_CS: IMU (R?#22.1 U?#7.12), MCU (R?#26.1)
IMU_MISO_MCU: IMU (R?#24.1), MCU (U?#9.22)
IMU_MOSI: IMU (U?#7.14), MCU (R?#28.1)
IMU_SCLK: IMU (U?#7.13), MCU (R?#27.1)
MAG_INT: Magnetometer (U?#8.7), MCU (U?#9.58)
MAG_SCL: Magnetometer (U?#8.1), MCU (U?#9.61)
MAG_SDA: Magnetometer (U?#8.4), MCU (U?#9.62)
MAX17048_ALERT: Power (U?#1.5), MCU (U?#9.59)
MAX17048_SCL: Power (U?#1.7), MCU (U?#9.30)
MAX17048_SCL: Power (U?#1.8), MCU (U?#9.29)
MEM_CS: MCU (R?#30.1), Memory (R?#37.2 U?#10.1)
MEM_MISO_MCU: MCU (U?#9.56), Memory (R?#40.1)
MEM_MOSI: MCU (R?#32.1), Memory (U?#10.5)
MEM_SCLK: MCU (R?#31.1), Memory (U?#10.6)